# EasyEDA Pro project Mixed PCB.eprj

# Schematic Part1

## Sheets
1 P1: Create Date: 2024-04-20; Page Name: P1; Project Name: Mixed PCB; Schematic Name: Part1; Update Date: 2024-04-20; Company: EasyEDA.com; Drawn: EasyEDA; Page Size: A4; Part Number: JLCPCB-002; Reviewed: EasyEDA; Version: V0.1
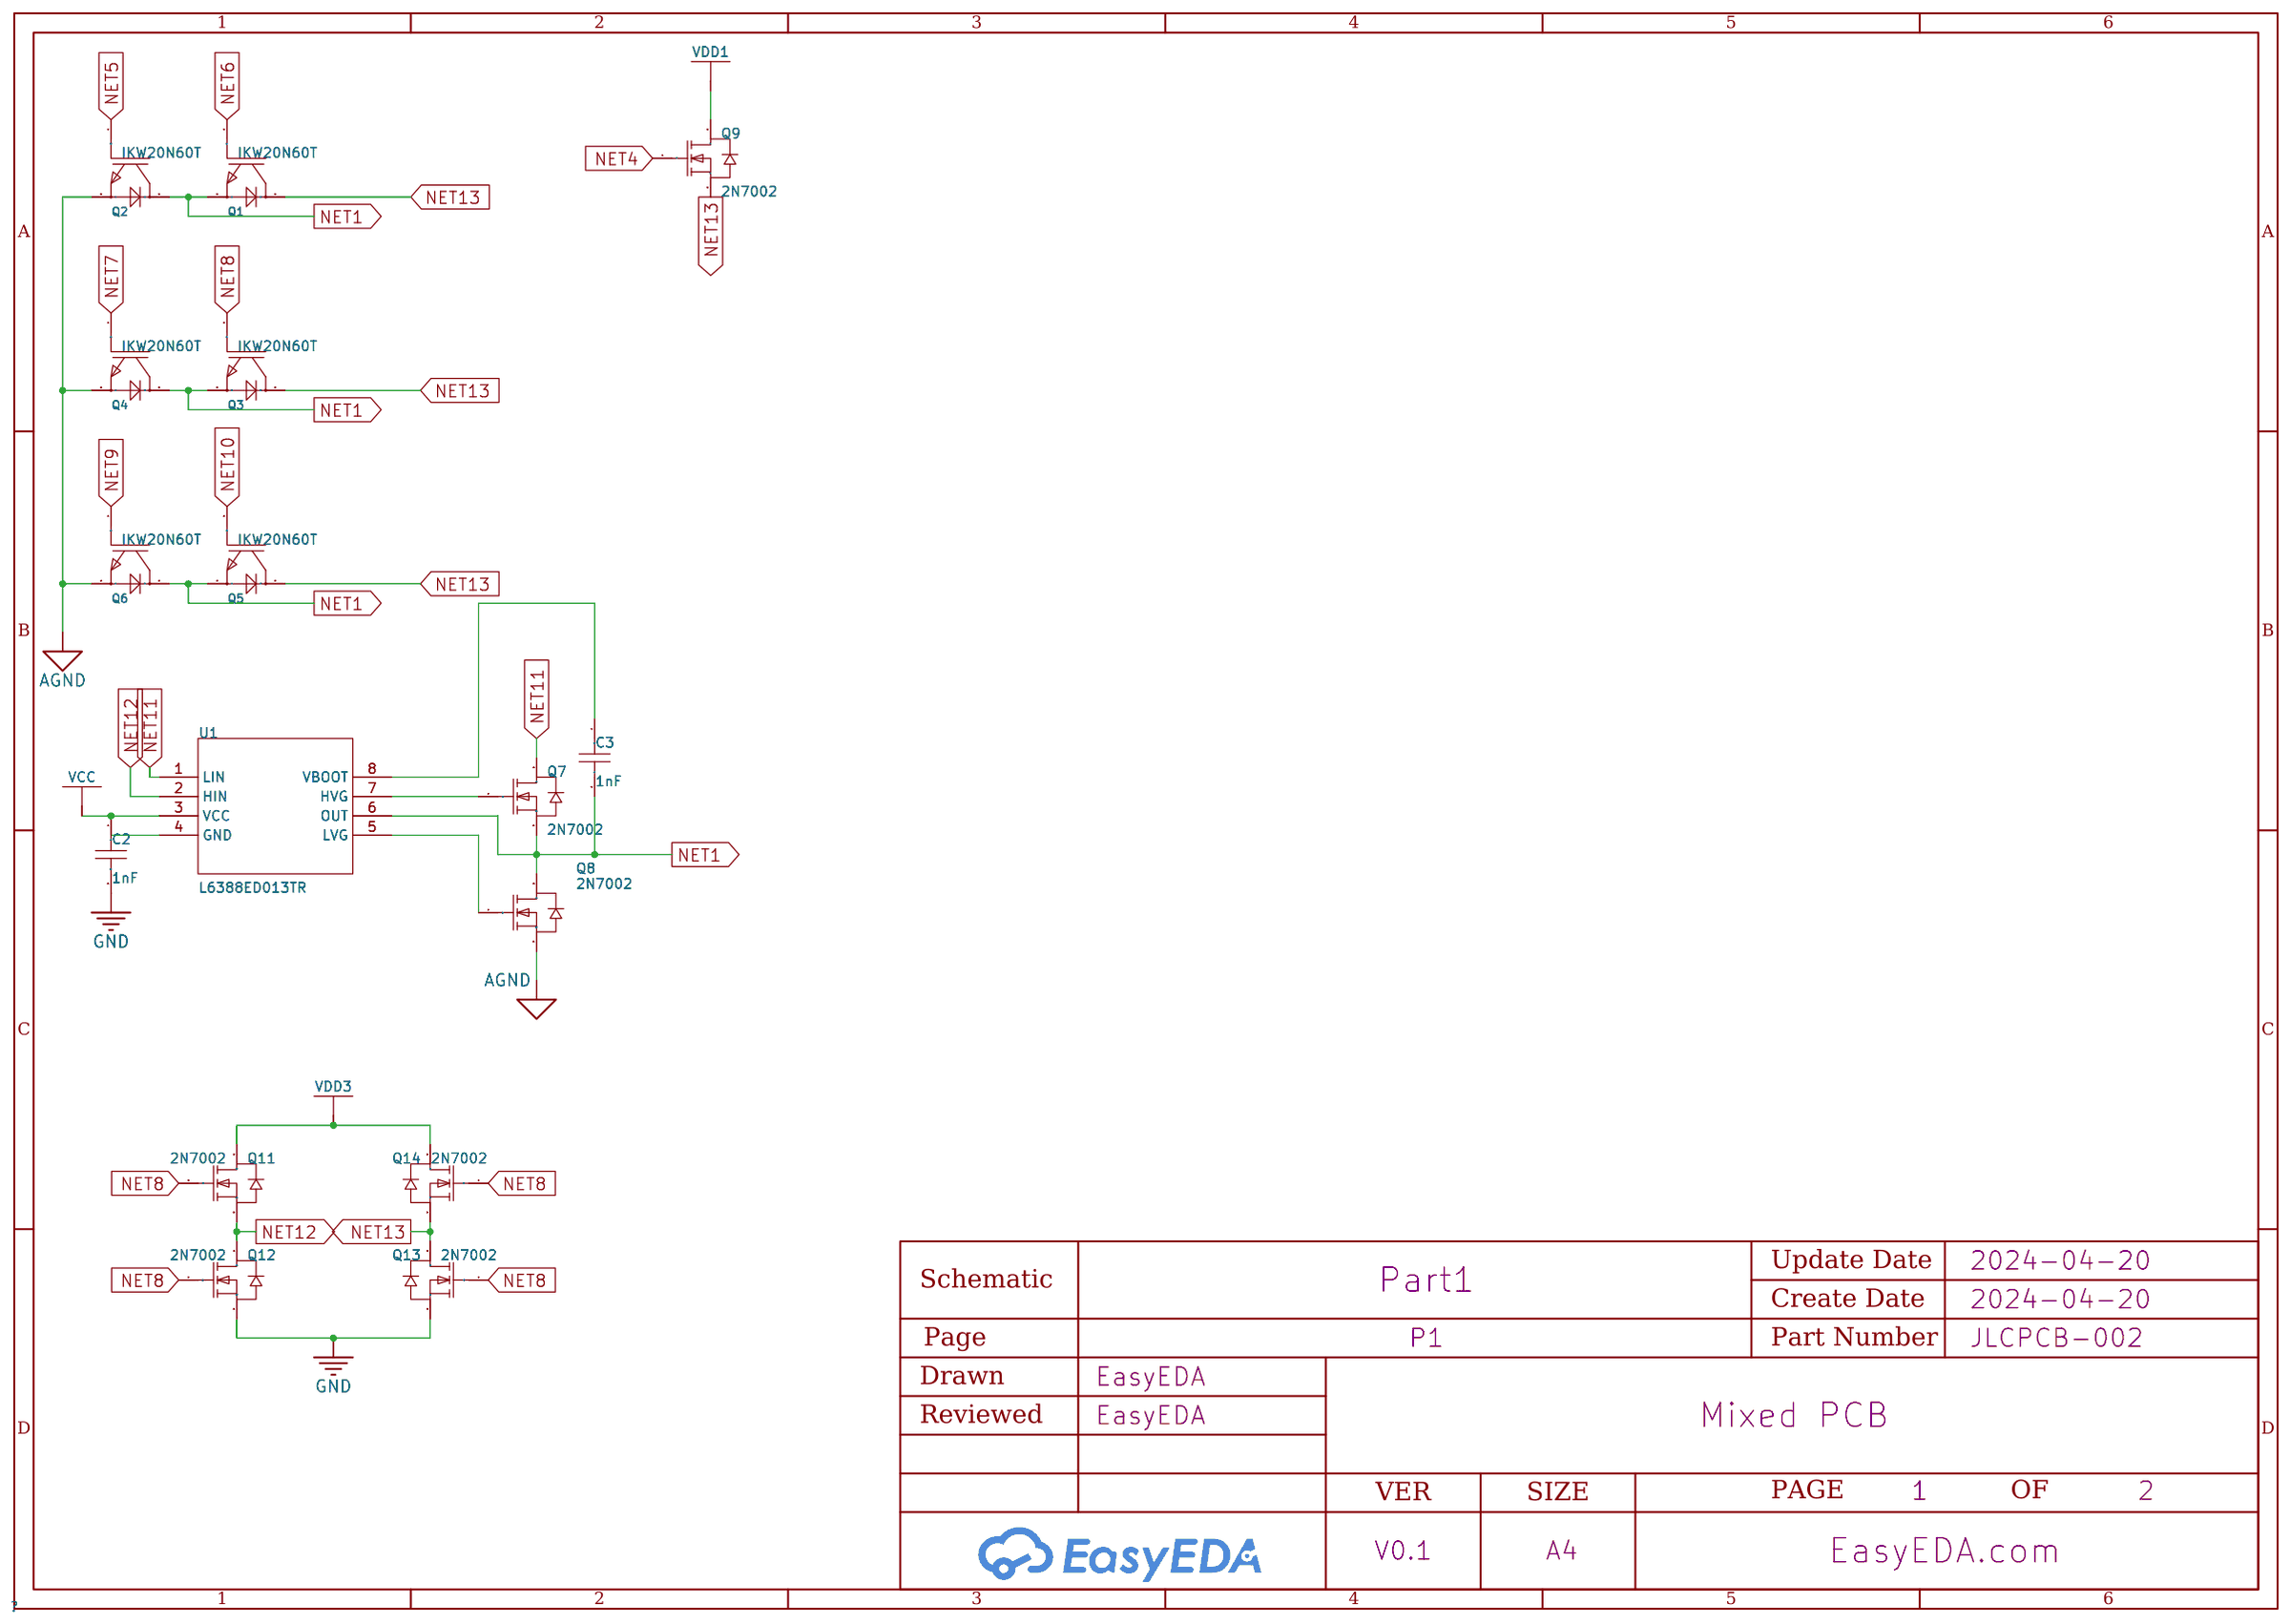
[diagram p0: P1]
2 P2: Page Name: P2
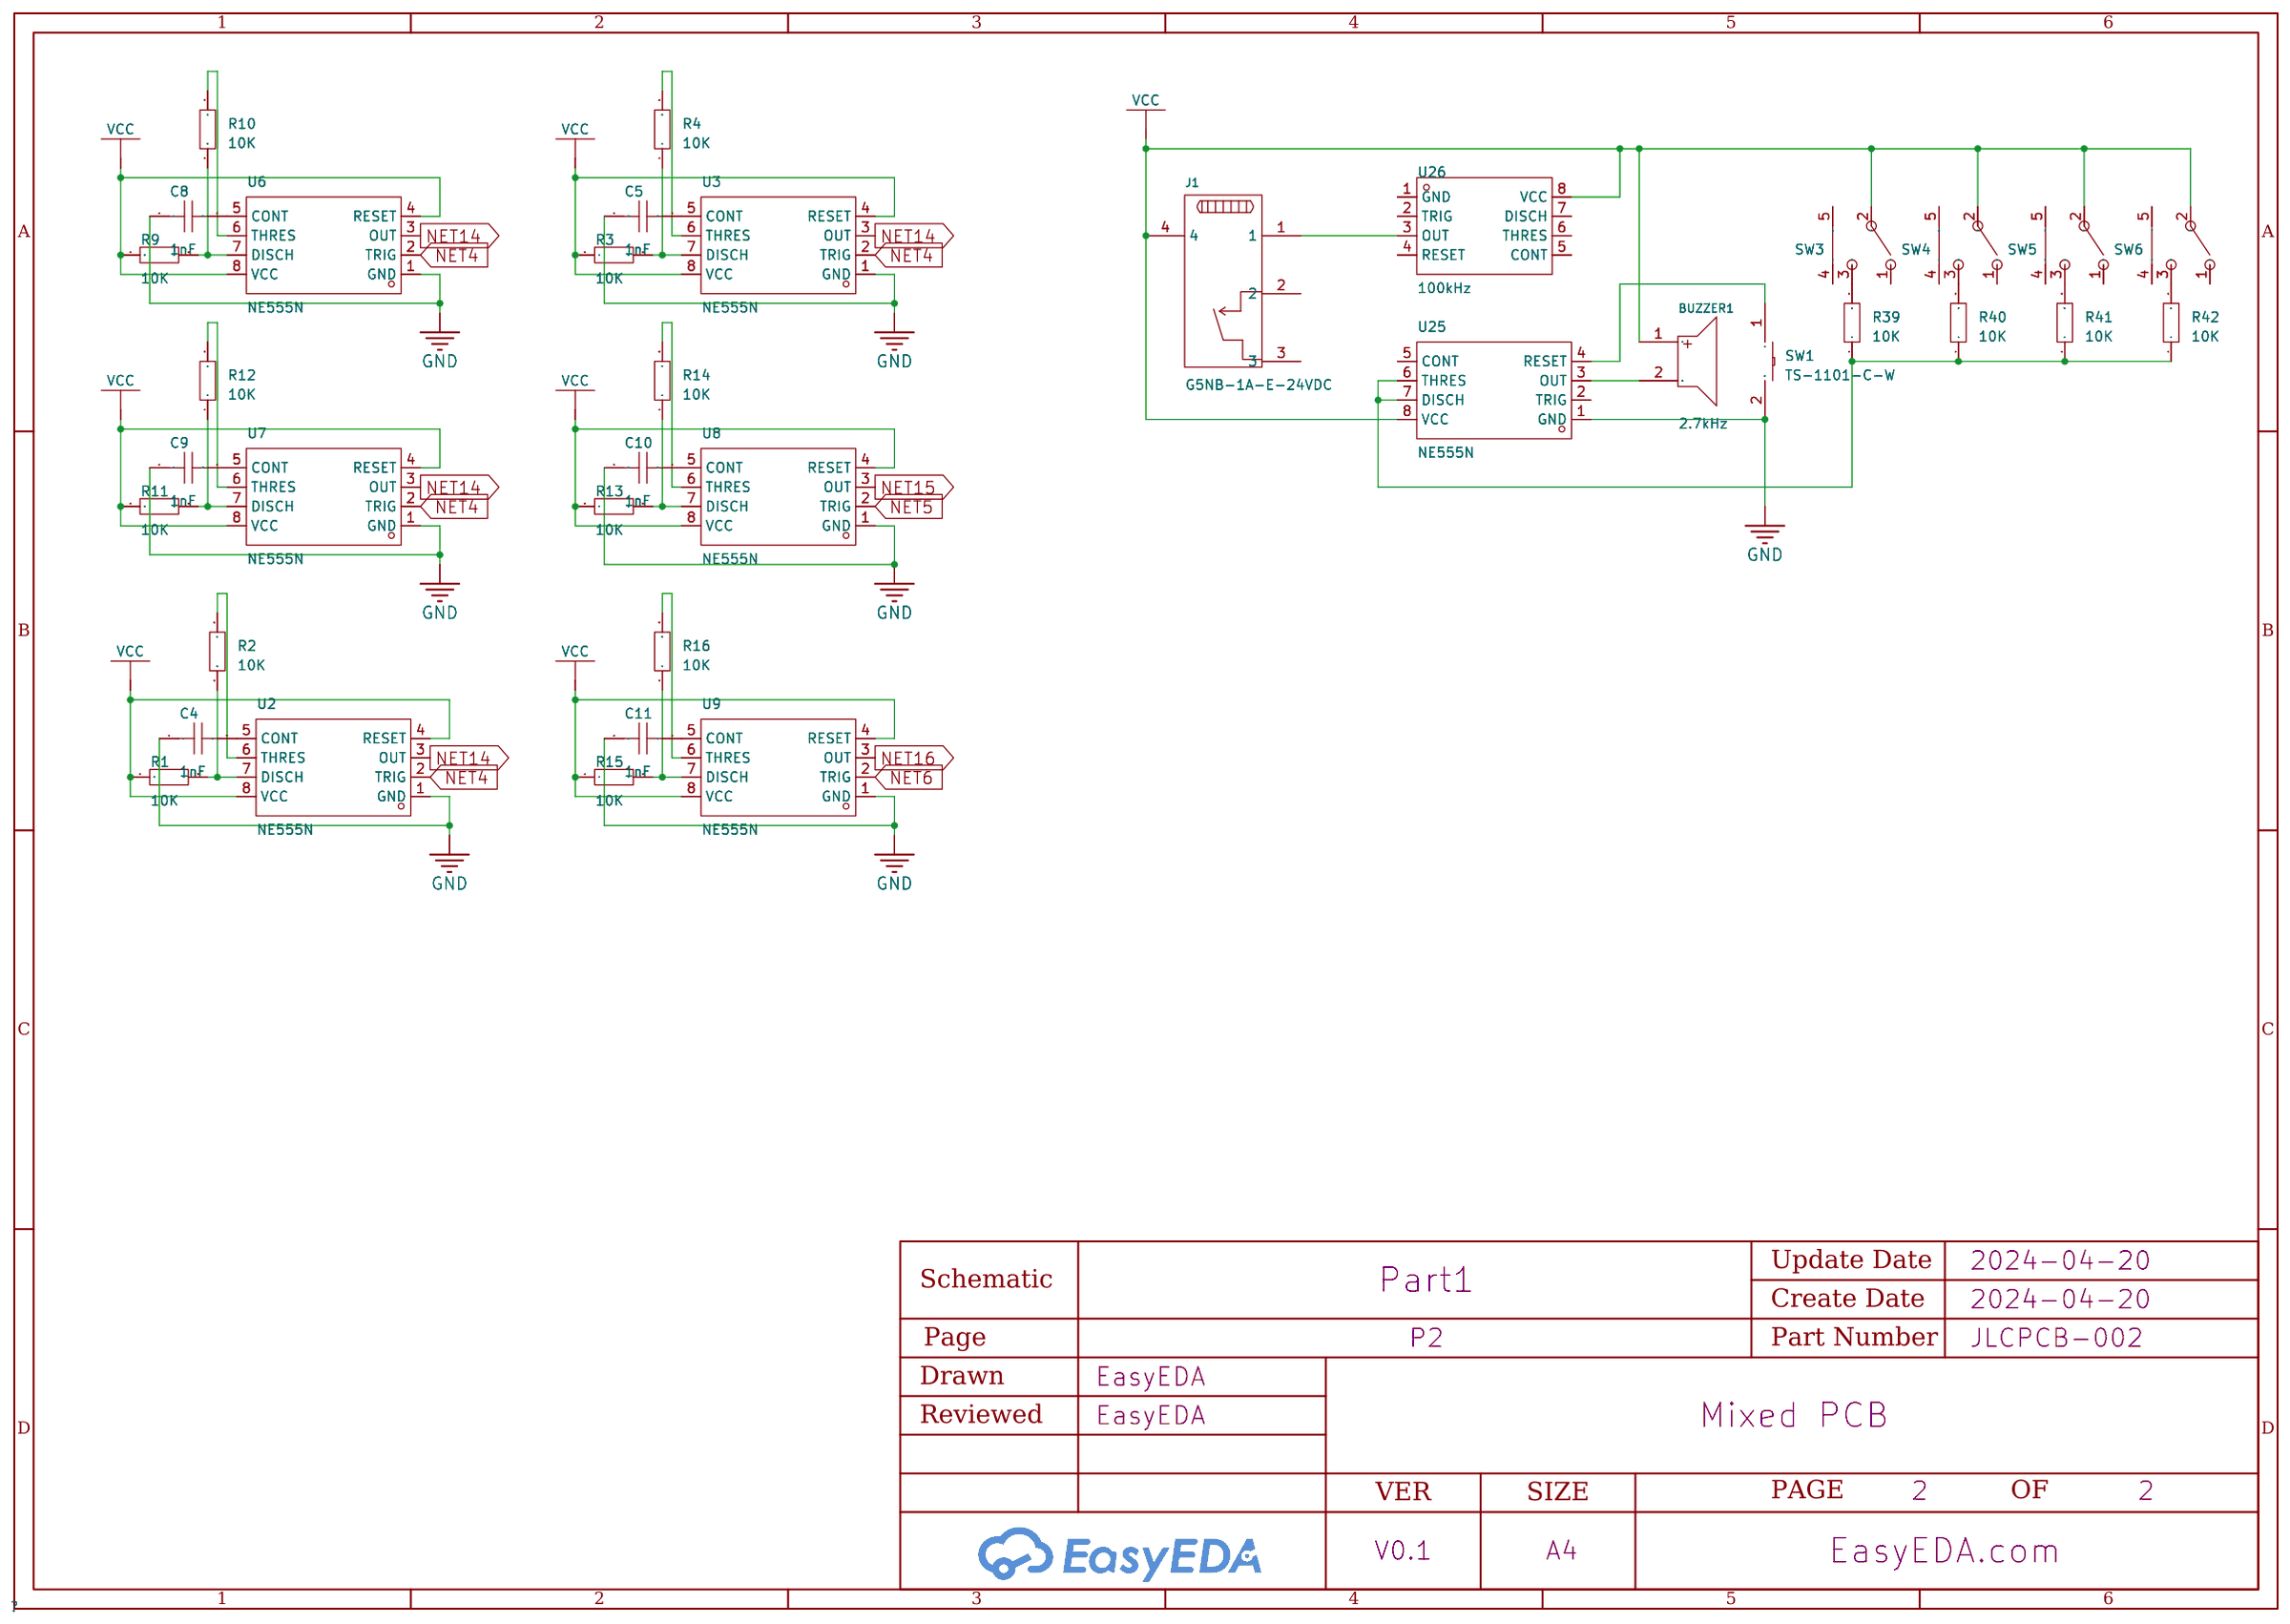
[diagram p1: P2]
3 P3: Page Name: P3
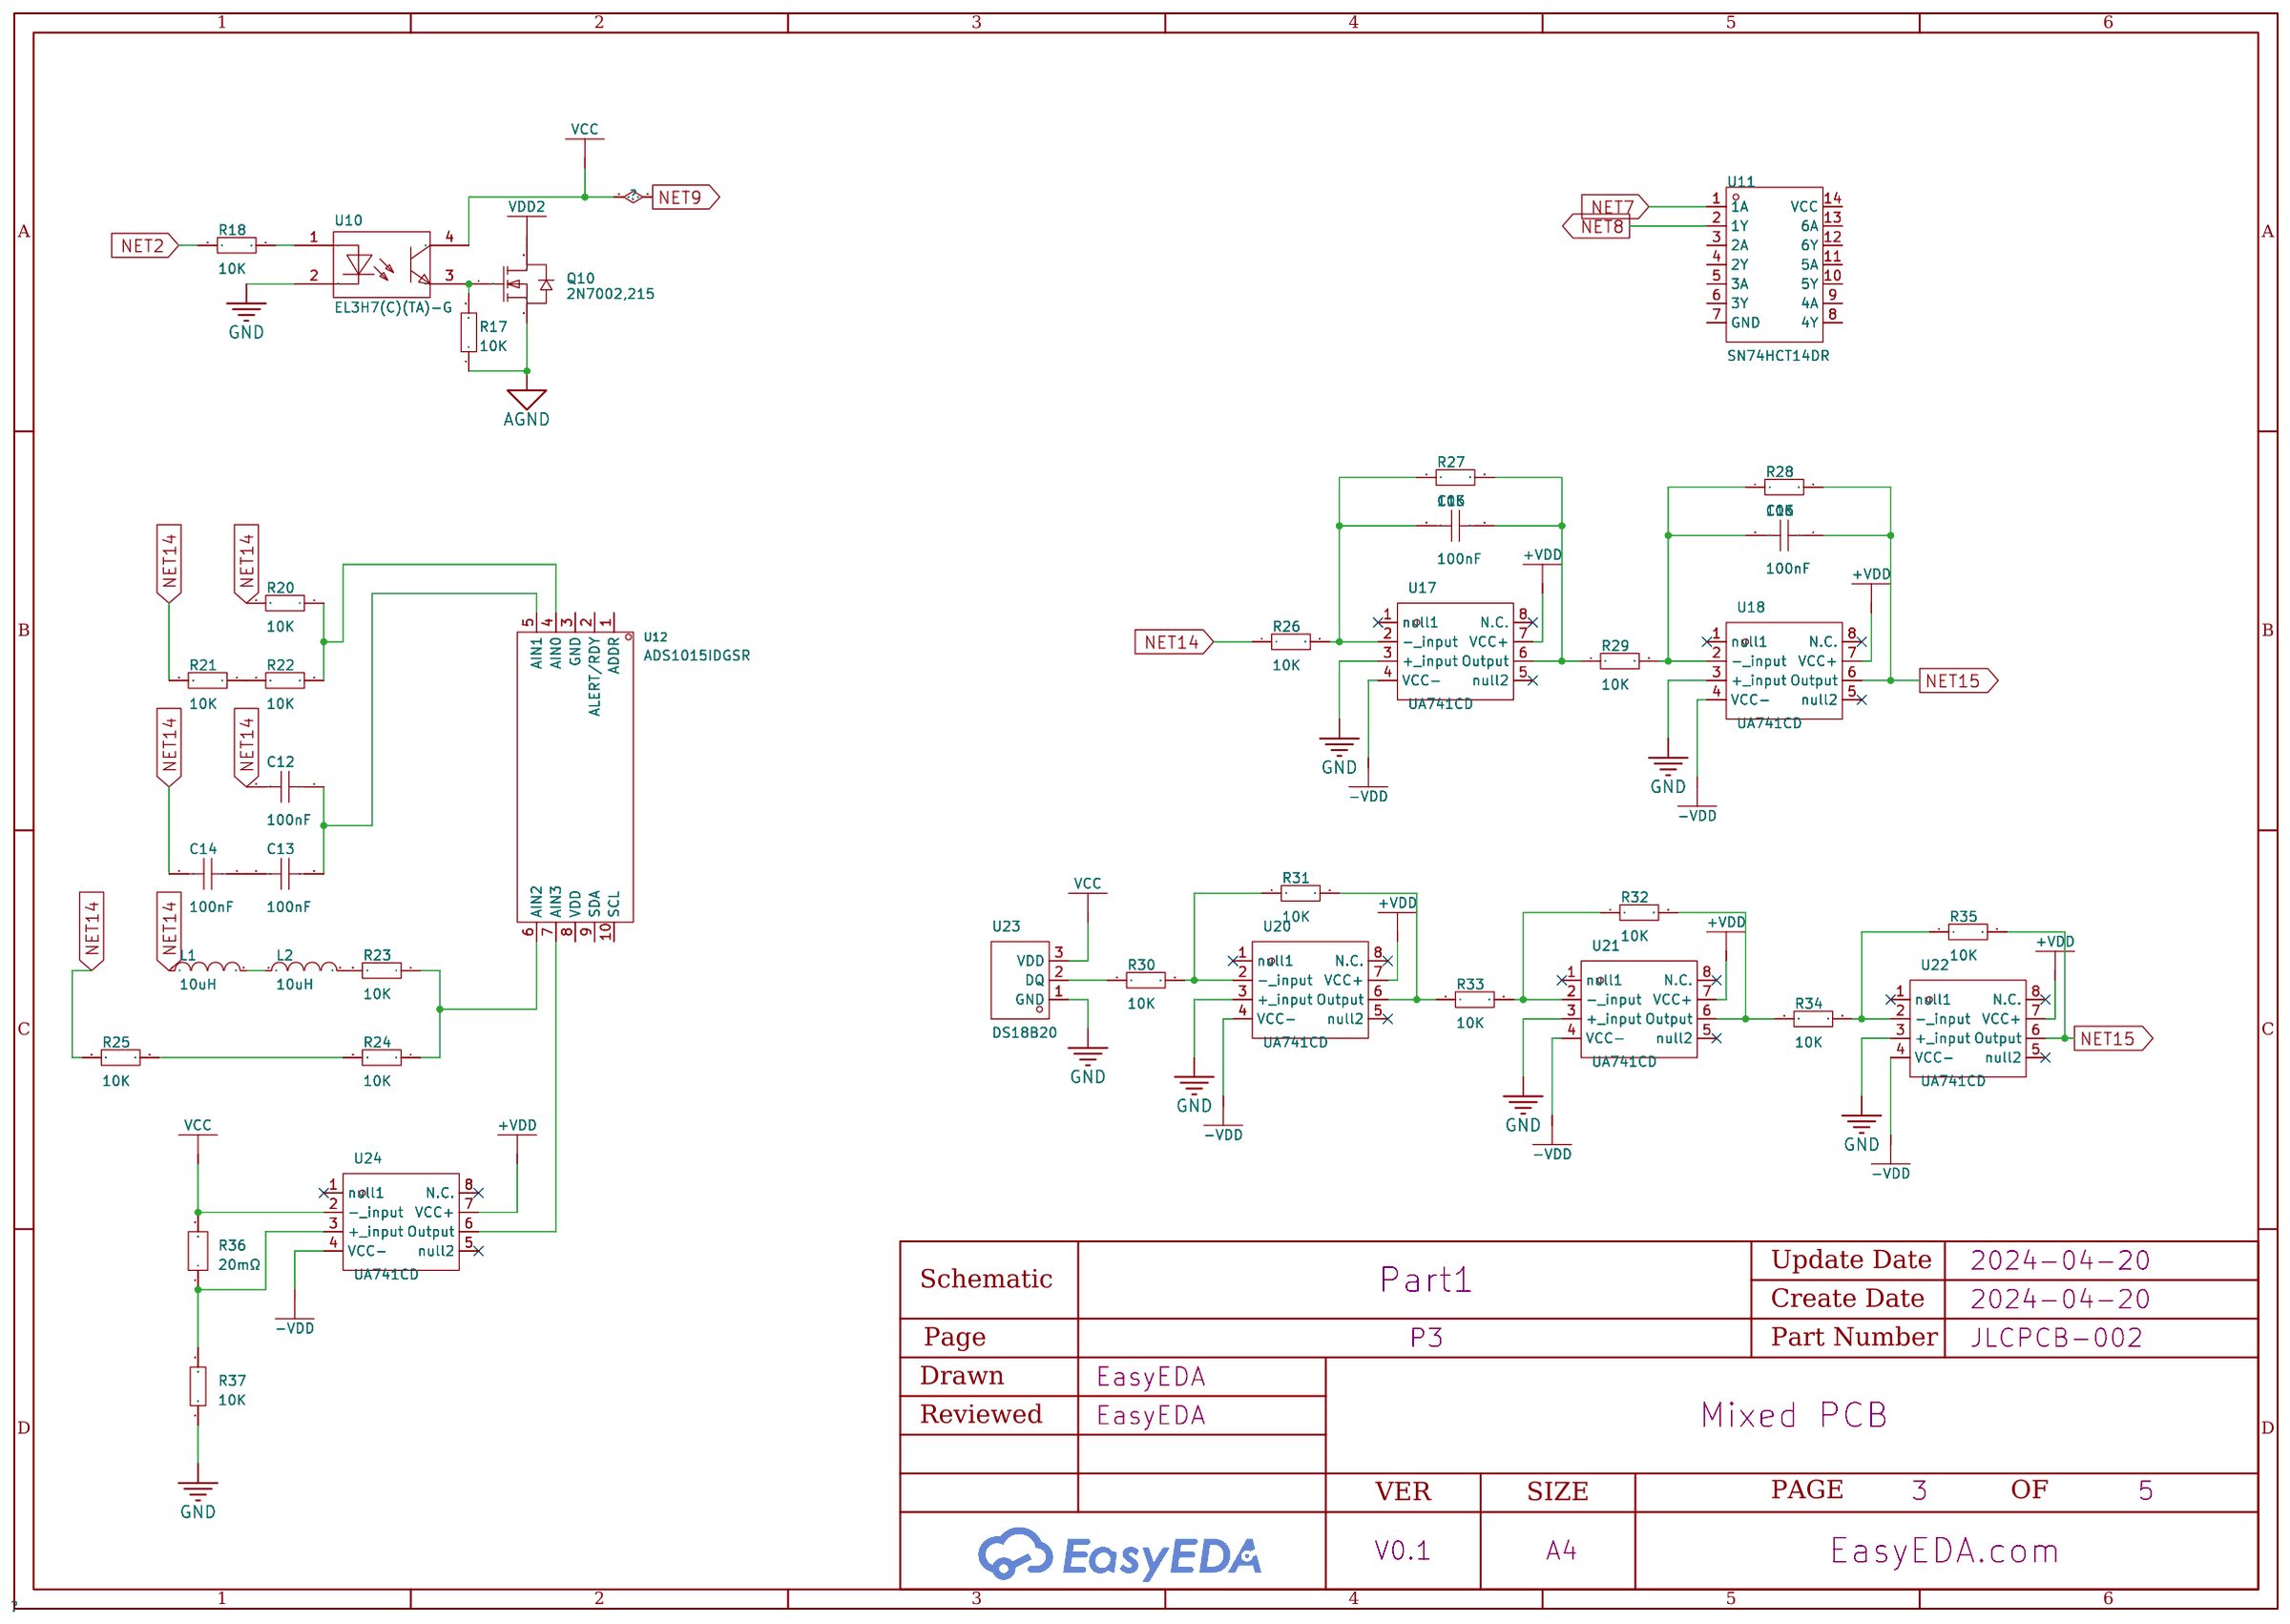
[diagram p2: P3]
4 P4: Page Name: P4
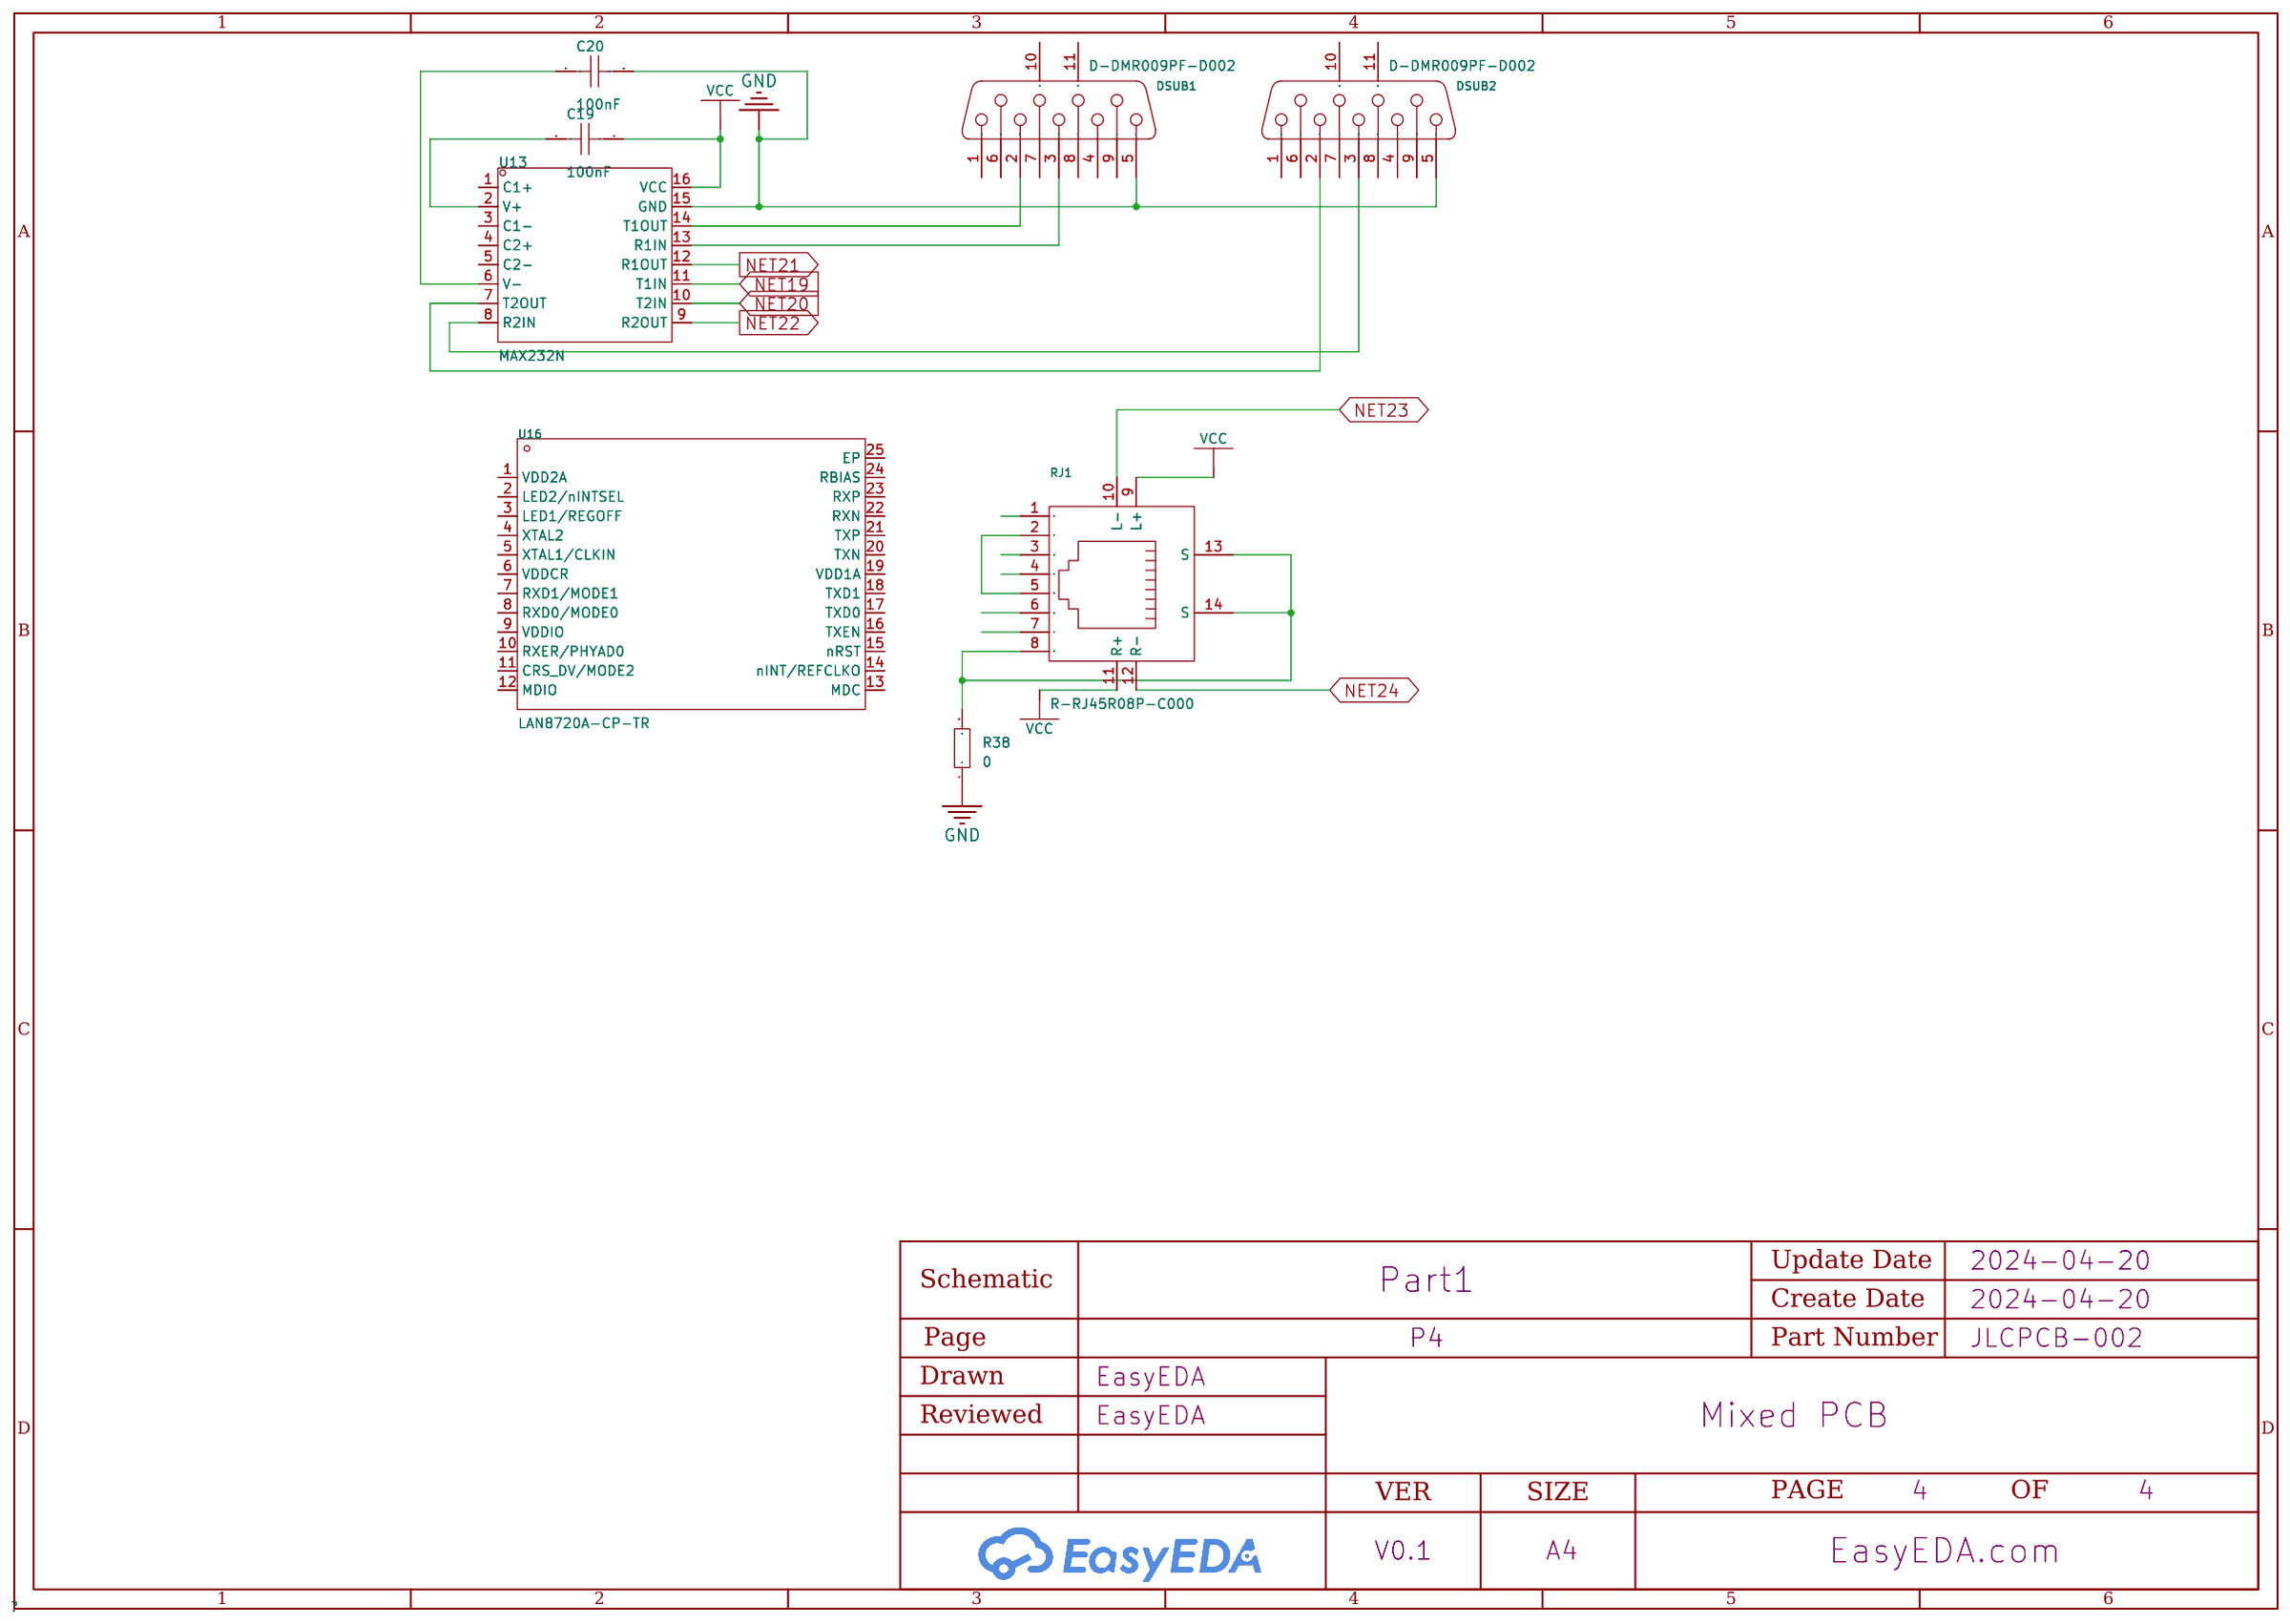
[diagram p3: P4]
5 P5: Page Name: P5
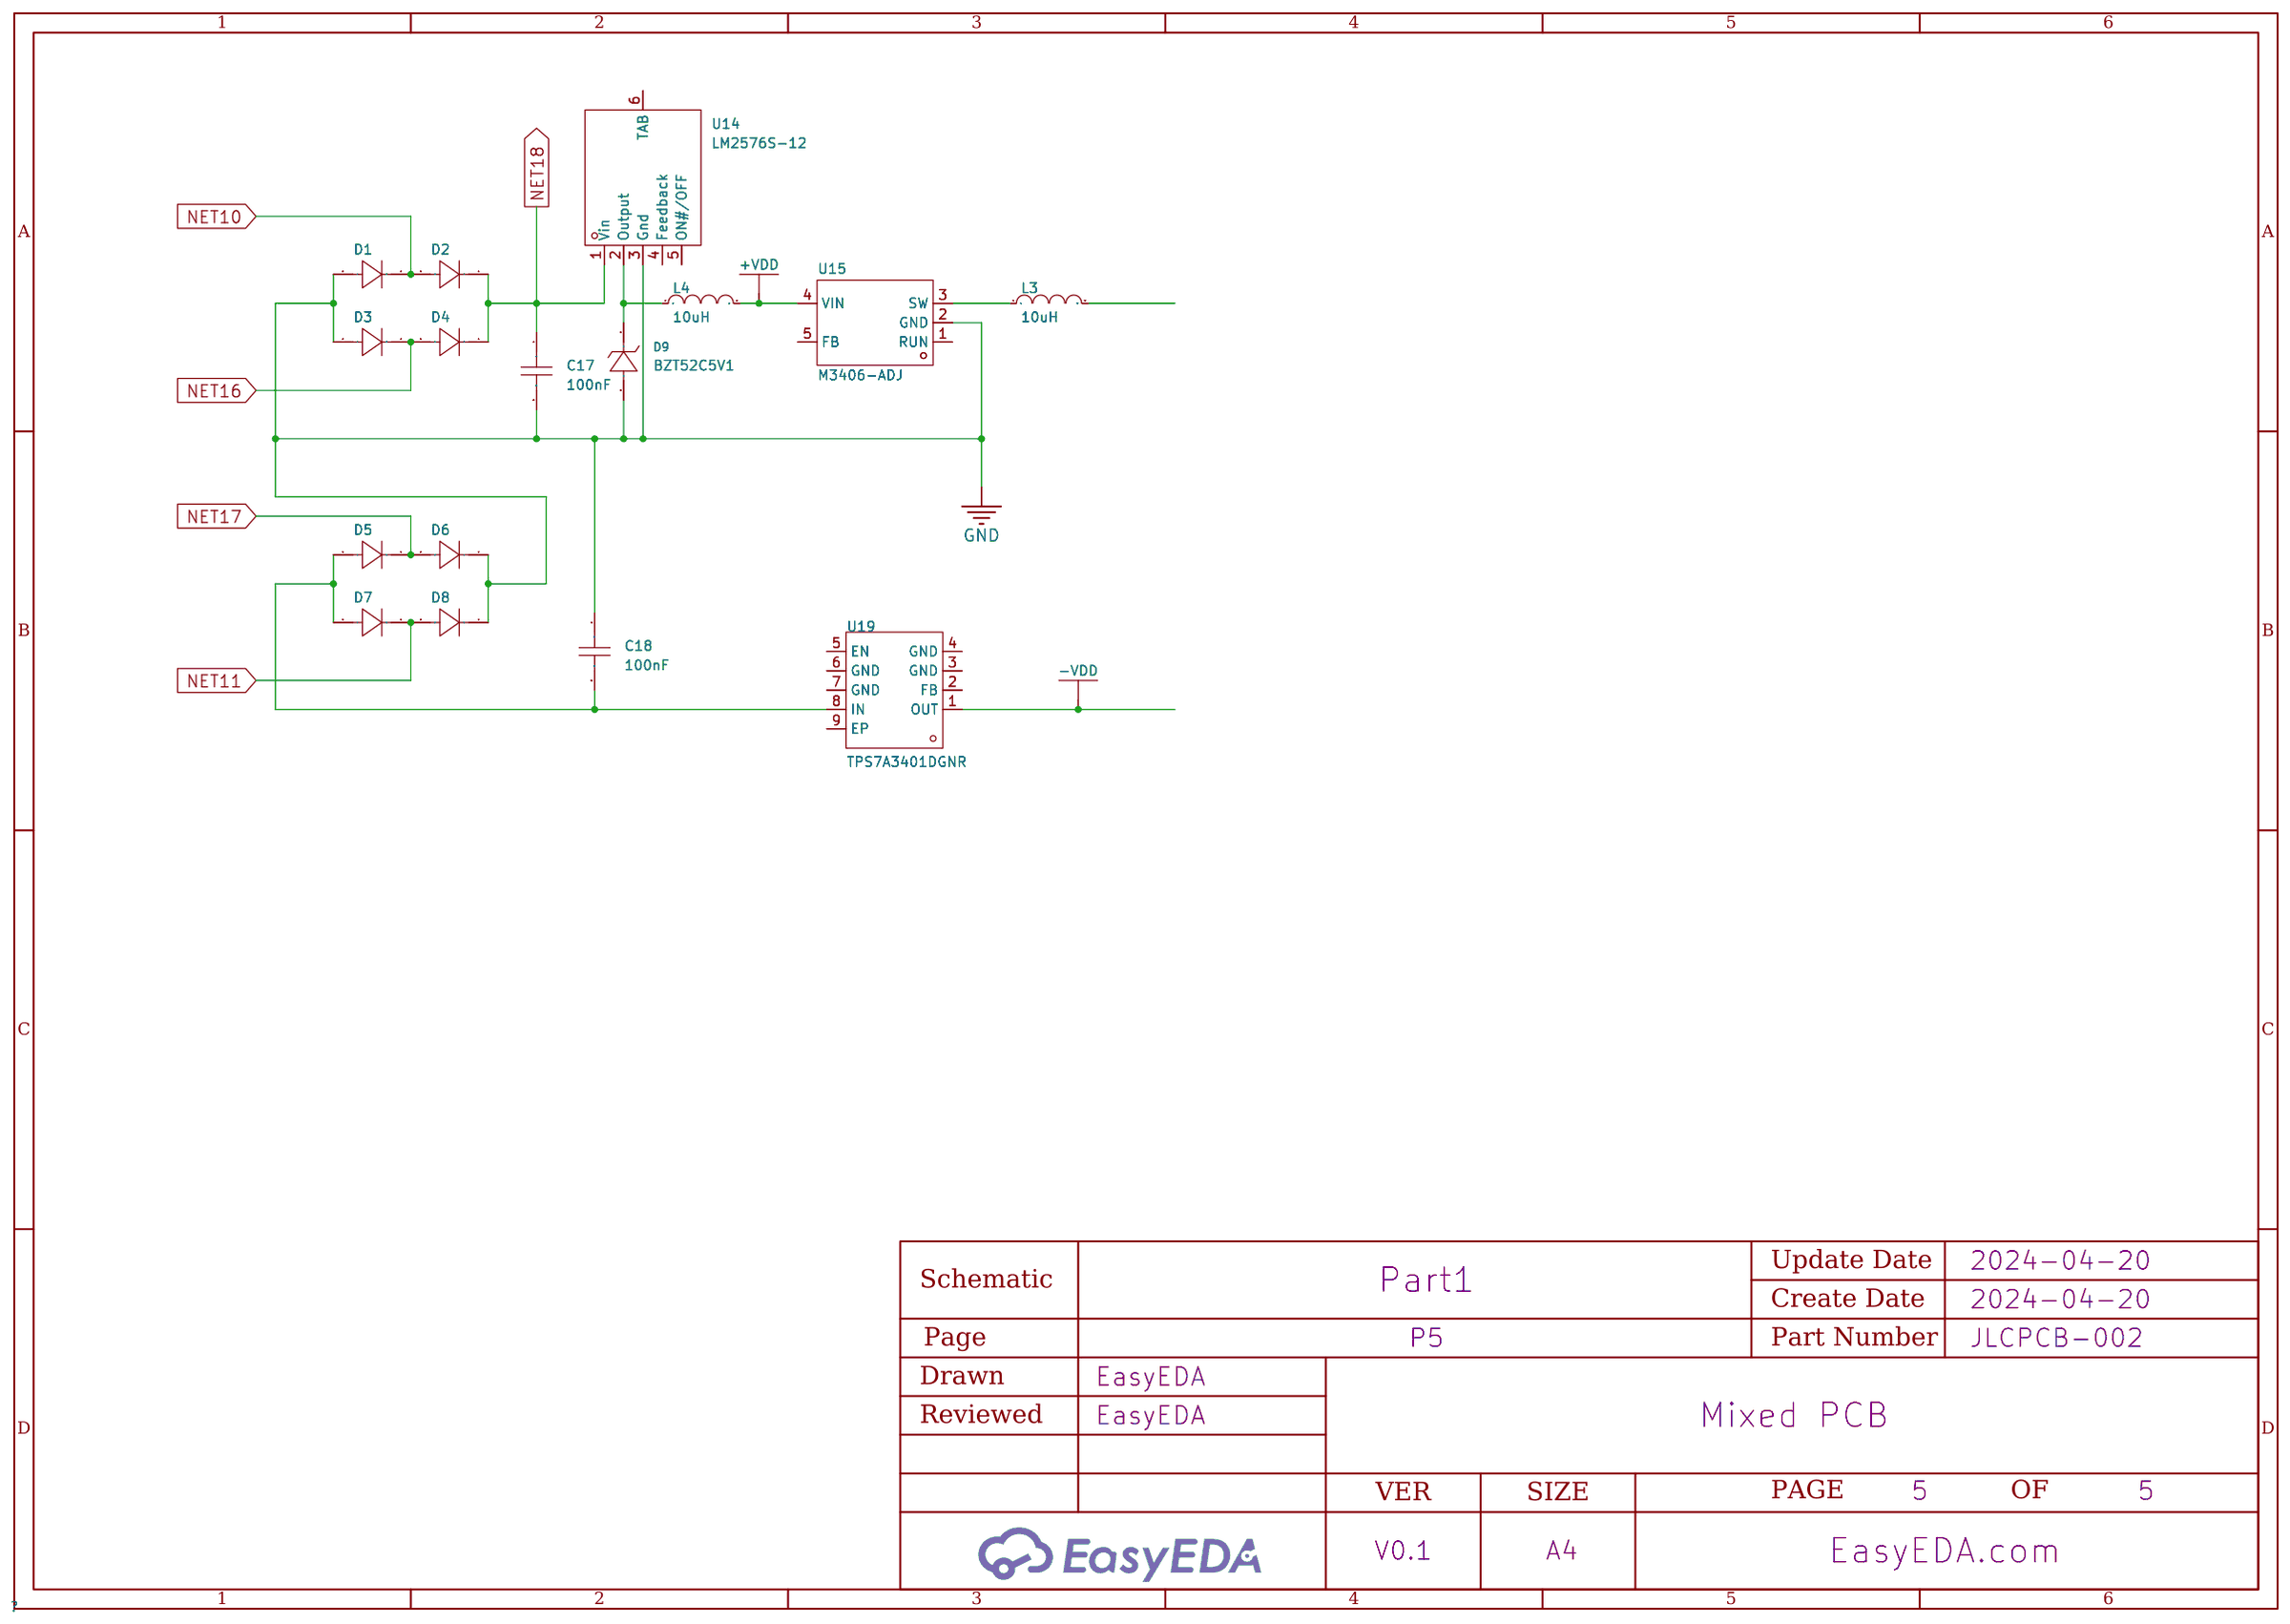
[diagram p4: P5]
6 P6: Page Name: P6; Update Date: 2024-04-21
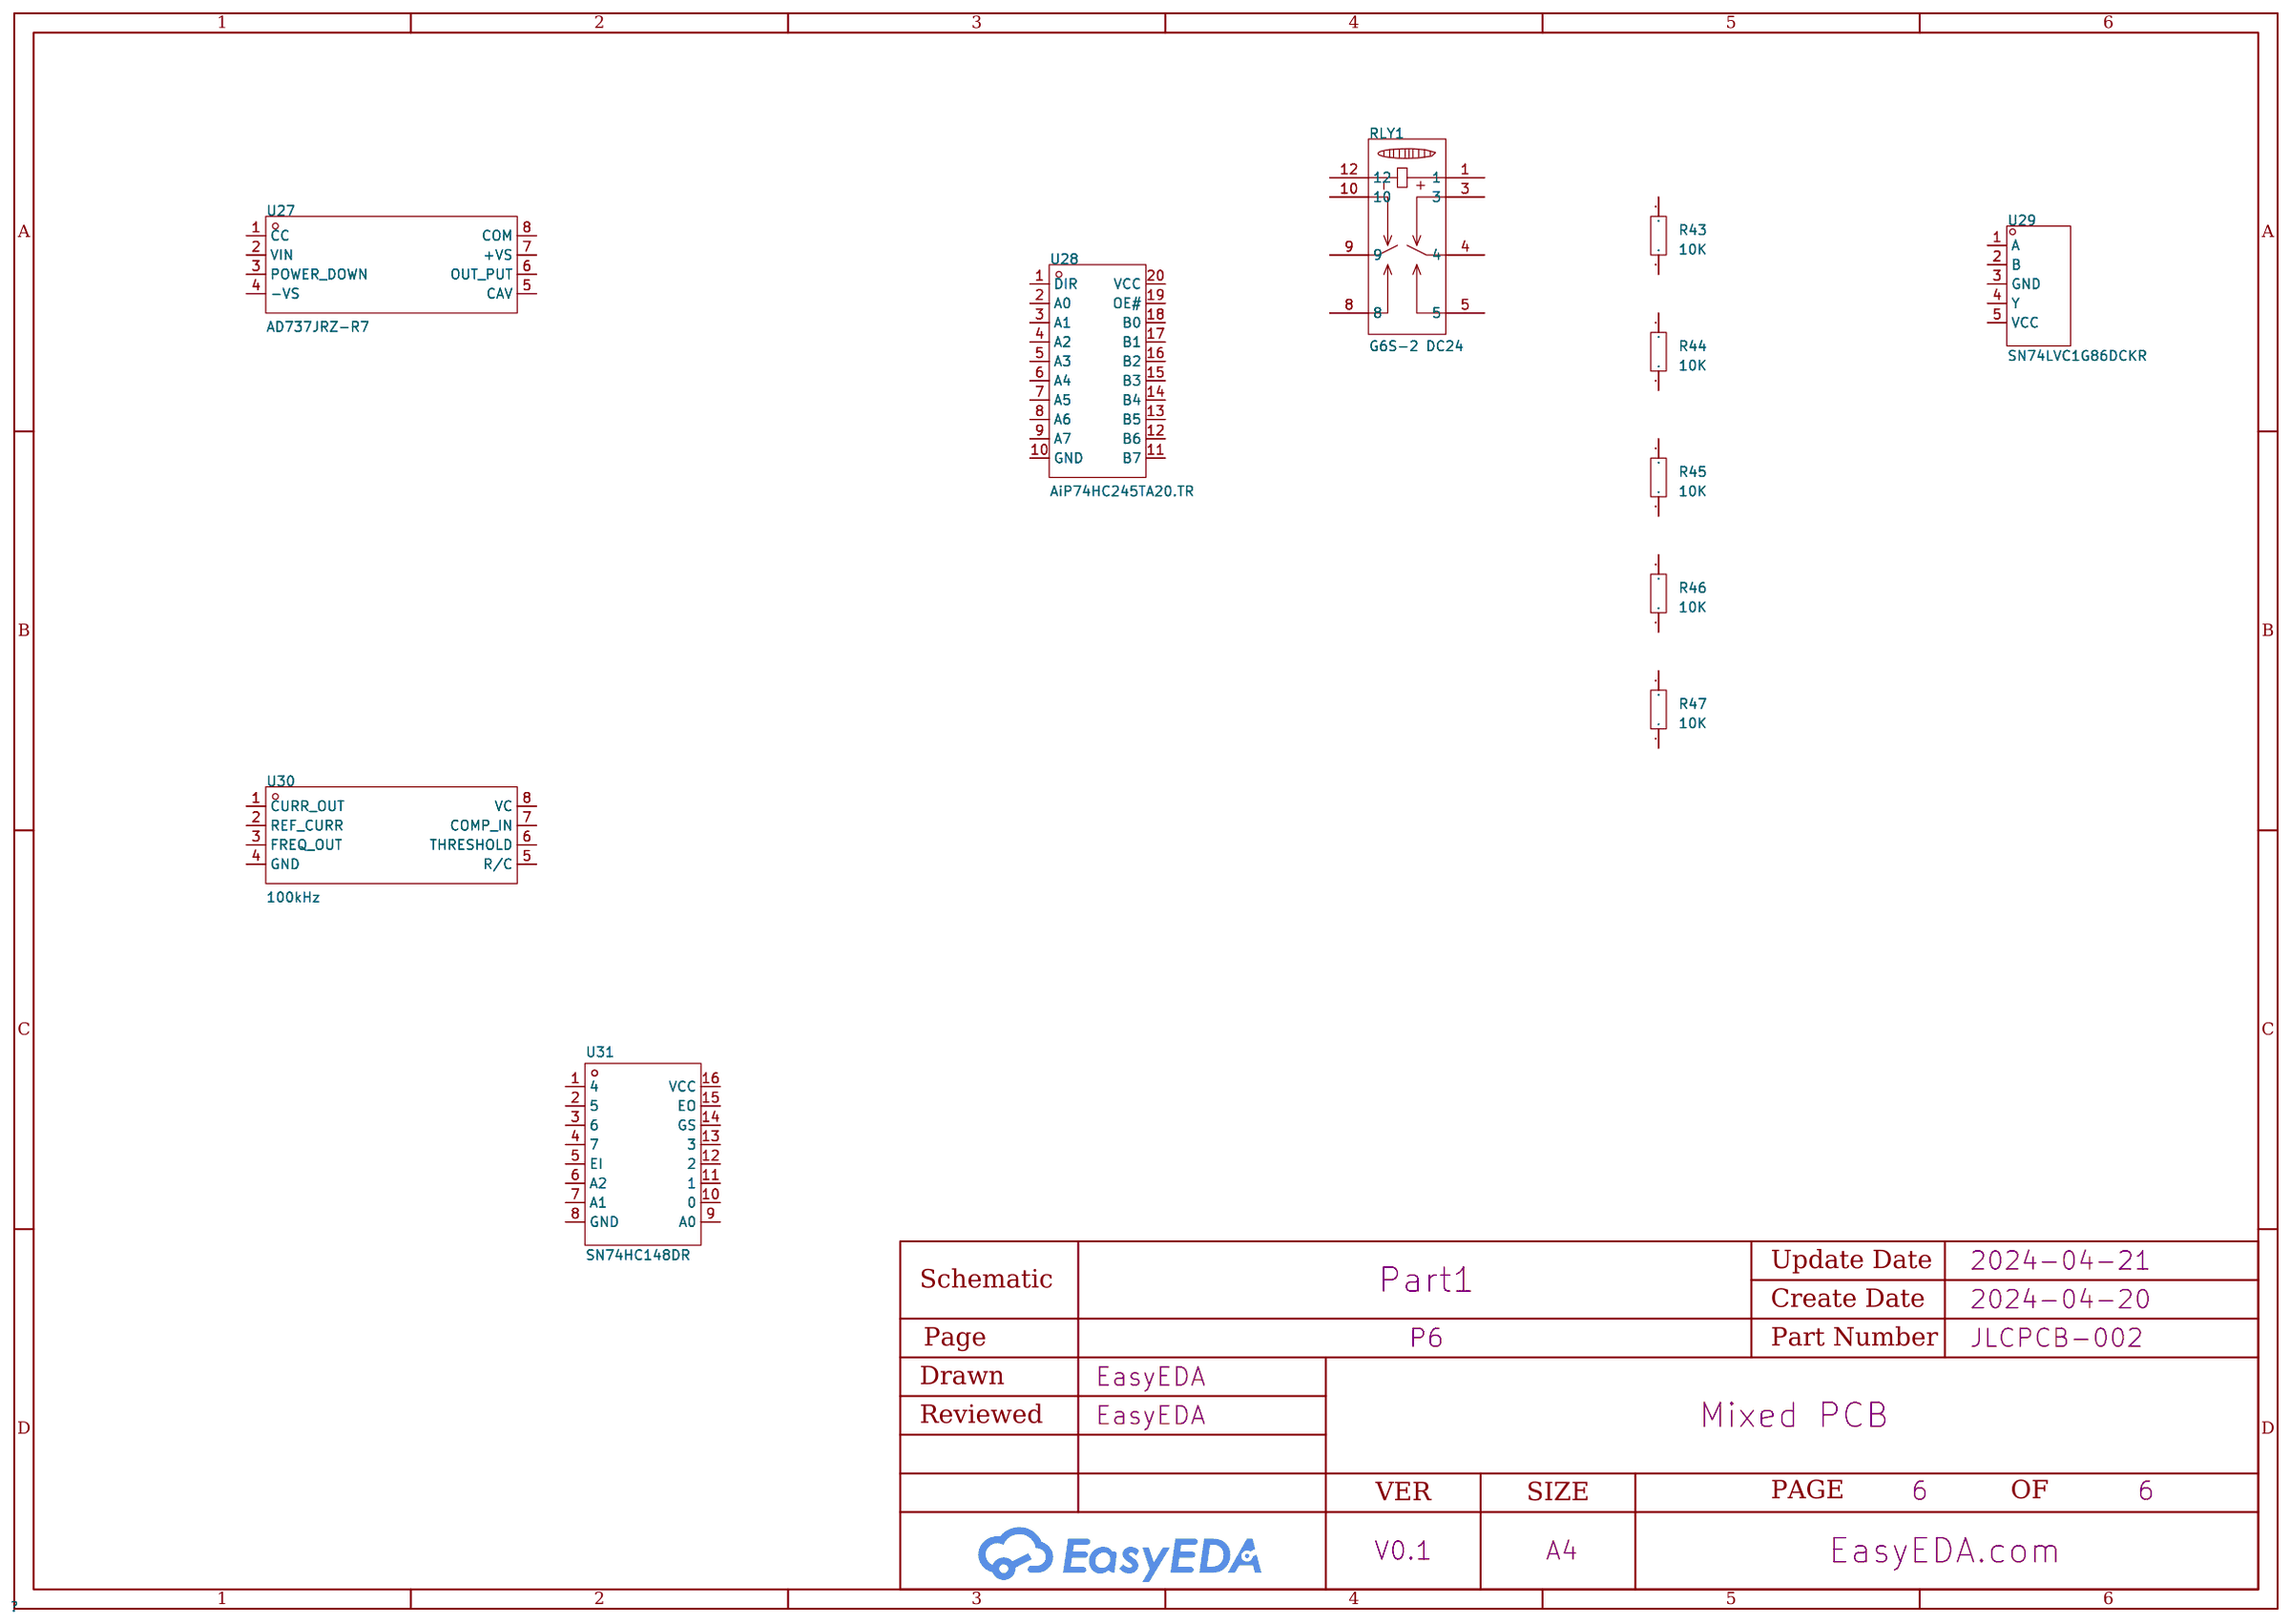
[diagram p5: P6]

## Parts
sheet P1
C2  1nF  [C0603]
C3  1nF  [C0603]
Q1  IKW20N60T  [TO-247AC-3_L15.8-W5.0-P5.46-L]
Q2  IKW20N60T  [TO-247AC-3_L15.8-W5.0-P5.46-L]
Q3  IKW20N60T  [TO-247AC-3_L15.8-W5.0-P5.46-L]
Q4  IKW20N60T  [TO-247AC-3_L15.8-W5.0-P5.46-L]
Q5  IKW20N60T  [TO-247AC-3_L15.8-W5.0-P5.46-L]
Q6  IKW20N60T  [TO-247AC-3_L15.8-W5.0-P5.46-L]
Q7  2N7002  [SOT-23-3_L2.9-W1.3-P1.90-LS2.4-BR]
Q8  2N7002  [SOT-23-3_L2.9-W1.3-P1.90-LS2.4-BR]
Q9  2N7002  [SOT-23-3_L2.9-W1.3-P1.90-LS2.4-BR]
Q11  2N7002  [SOT-23-3_L2.9-W1.3-P1.90-LS2.4-BR]
Q12  2N7002  [SOT-23-3_L2.9-W1.3-P1.90-LS2.4-BR]
Q13  2N7002  [SOT-23-3_L2.9-W1.3-P1.90-LS2.4-BR]
Q14  2N7002  [SOT-23-3_L2.9-W1.3-P1.90-LS2.4-BR]
U1  L6388ED013TR  [SOIC-8_L5.0-W4.0-P1.27-LS6.0-BL]
sheet P2
BUZZER1  2.7kHz  [BUZ-TH_BD9.0-P4.00-D0.6-FD]
C4  1nF  [C0603]
C5  1nF  [C0603]
C8  1nF  [C0603]
C9  1nF  [C0603]
C10  1nF  [C0603]
C11  1nF  [C0603]
J1  G5NB-1A-E-24VDC  [RELAY-TH_G5NB-1A-E-24VDC]
R1  10K  [R0603]
R2  10K  [R0603]
R3  10K  [R0603]
R4  10K  [R0603]
R9  10K  [R0603]
R10  10K  [R0603]
R11  10K  [R0603]
R12  10K  [R0603]
R13  10K  [R0603]
R14  10K  [R0603]
R15  10K  [R0603]
R16  10K  [R0603]
R39  10K  [R0603]
R40  10K  [R0603]
R41  10K  [R0603]
R42  10K  [R0603]
SW1  TS-1101-C-W  [SW-SMD_L6.0-W3.3-LS8.0]
SW3  ST-0-102-C03-N003-RS  [SW-TH_ST-0-102-C03-N003-RS]
SW4  ST-0-102-C03-N003-RS  [SW-TH_ST-0-102-C03-N003-RS]
SW5  ST-0-102-C03-N003-RS  [SW-TH_ST-0-102-C03-N003-RS]
SW6  ST-0-102-C03-N003-RS  [SW-TH_ST-0-102-C03-N003-RS]
U2  NE555N  [DIP-8_L9.8-W6.6-P2.54-LS7.6-BL]
U3  NE555N  [DIP-8_L9.8-W6.6-P2.54-LS7.6-BL]
U6  NE555N  [DIP-8_L9.8-W6.6-P2.54-LS7.6-BL]
U7  NE555N  [DIP-8_L9.8-W6.6-P2.54-LS7.6-BL]
U8  NE555N  [DIP-8_L9.8-W6.6-P2.54-LS7.6-BL]
U9  NE555N  [DIP-8_L9.8-W6.6-P2.54-LS7.6-BL]
U25  NE555N  [DIP-8_L9.8-W6.6-P2.54-LS7.6-BL]
U26  100kHz  [DIP-8_L9.8-W6.6-P2.54-LS7.6-BL]
sheet P3
C12  100nF  [C0603]
C13  100nF  [C0603]
C14  100nF  [C0603]
C15  100nF  [C0603]
C16  100nF  [C0603]
L1  10uH  [L0603]
L2  10uH  [L0603]
Q10  2N7002,215  [SOT-23_L2.9-W1.3-P1.90-LS2.4-BR]
R17  10K  [R0603]
R18  10K  [R0603]
R20  10K  [R0603]
R21  10K  [R0603]
R22  10K  [R0603]
R23  10K  [R0603]
R24  10K  [R0603]
R25  10K  [R0603]
R26  10K  [R0603]
R27  10K  [R0603]
R28  10K  [R0603]
R29  10K  [R0603]
R30  10K  [R0603]
R31  10K  [R0603]
R32  10K  [R0603]
R33  10K  [R0603]
R34  10K  [R0603]
R35  10K  [R0603]
R36  20mΩ  [R1206]
R37  10K  [R0603]
U10  EL3H7(C)(TA)-G  [SMD-4_L2.7-W4.4-P1.27-LS7.0-BL]
U11  SN74HCT14DR  [SOIC-14_L8.7-W3.9-P1.27-LS6.0-BL]
U12  ADS1015IDGSR  [VSSOP-10_L3.0-W3.0-P0.50-LS4.9-BL]
U17  UA741CD  [SO-8_L4.9-W3.9-P1.27-LS6.0-BL]
U18  UA741CD  [SO-8_L4.9-W3.9-P1.27-LS6.0-BL]
U20  UA741CD  [SO-8_L4.9-W3.9-P1.27-LS6.0-BL]
U21  UA741CD  [SO-8_L4.9-W3.9-P1.27-LS6.0-BL]
U22  UA741CD  [SO-8_L4.9-W3.9-P1.27-LS6.0-BL]
U23  DS18B20  [TO-92-3_L4.9-W3.7-P1.27-L]
U24  UA741CD  [SO-8_L4.9-W3.9-P1.27-LS6.0-BL]
sheet P4
C19  100nF  [C0603]
C20  100nF  [C0603]
DSUB1  D-DMR009PF-D002  [DSUB-TH_DMR-9S]
DSUB2  D-DMR009PF-D002  [DSUB-TH_DMR-9S]
R38  0  [R0603]
RJ1  R-RJ45R08P-C000  [RJ45-TH_R-RJ45R08P-C000]
U13  MAX232N  [PDIP-16_L19.7-W6.6-P2.54-LS7.8-BL]
U16  LAN8720A-CP-TR  [QFN-24_L4.0-W4.0-P0.50-BL-EP2.6]
sheet P5
C17  100nF  [C0603]
C18  100nF  [C0603]
D1  -  [DO-41_BD2.4-L4.7-P8.70-D0.9-RD]
D2  -  [DO-41_BD2.4-L4.7-P8.70-D0.9-RD]
D3  -  [DO-41_BD2.4-L4.7-P8.70-D0.9-RD]
D4  -  [DO-41_BD2.4-L4.7-P8.70-D0.9-RD]
D5  -  [DO-41_BD2.4-L4.7-P8.70-D0.9-RD]
D6  -  [DO-41_BD2.4-L4.7-P8.70-D0.9-RD]
D7  -  [DO-41_BD2.4-L4.7-P8.70-D0.9-RD]
D8  -  [DO-41_BD2.4-L4.7-P8.70-D0.9-RD]
D9  BZT52C5V1  [SOD-123_L2.8-W1.8-LS3.7-RD-1]
L3  10uH  [L0603]
L4  10uH  [L0603]
U14  LM2576S-12  [TO-263-5_L10.2-W8.9-P1.70-BR]
U15  M3406-ADJ  [SOT-23-5_L3.0-W1.7-P0.95-LS2.8-BR]
U19  TPS7A3401DGNR  [MSOP-8_L3.0-W3.0-P0.65-LS4.9-BL-EP]
sheet P6
R43  10K  [R0603]
R44  10K  [R0603]
R45  10K  [R0603]
R46  10K  [R0603]
R47  10K  [R0603]
RLY1  G6S-2 DC24  [RELAY-TH_G6S-2-4.5V]
U27  AD737JRZ-R7  [SOIC-8_L4.9-W3.9-P1.27-LS6.0-BL]
U28  AiP74HC245TA20.TR  [TSSOP-20_L6.5-W4.4-P0.65-LS6.5-BL]
U29  SN74LVC1G86DCKR  [SC-70-5_L2.1-W1.3-P0.65-LS2.1-BR]
U30  100kHz  [SOP-8_L4.9-W3.9-P1.27-LS6.0-BL]
U31  SN74HC148DR  [SOIC-16_L9.9-W3.9-P1.27-LS6.0-BL]

## Library data of the parts
C2-C5 C8-C20 = CAP_0603: Supplier Footprint: 0603
Q1-Q6 = IKW20N60T: Supplier Part: C10456; Manufacturer: Infineon(英飞凌); Supplier Footprint: TO-247AC-3; JLCPCB Part Class: Extended Part; Datasheet: https://atta.szlcsc.com/upload/public/pdf/source/20121215/1457706569365.pdf; Supplier: LCSC
Q7-Q9 Q11-Q14 = 2N7002_C8545: Type: Drain Source Voltage (Vdss): Continuous Drain Current (Id): Power Dissipation (Pd): Drain Source On Resistance (RDS(on)@Vgs,Id):7.5Ω@10V,500mA Gate Threshold Voltage (Vgs(th)@Id):2.5V@250uA; LCSC Part Name: N沟道 耐压:60V 电流:115mA; Supplier Part: C8545; Manufacturer: CJ(江苏长电/长晶); Supplier Footprint: SOT-23; JLCPCB Part Class: Basic Part; Datasheet: https://atta.szlcsc.com/upload/public/pdf/source/20171228/C164913_15144413269051213916.pdf; Supplier: LCSC; Drain Source On Resistance (RDS(on)@Vgs,Id): 7.5Ω@10V,500mA; Gate Threshold Voltage (Vgs(th)@Id): 2.5V@250uA
U1 = L6388ED013TR: Driven Configuration:Half Bridge Load Type:MOSFET；IGBT Number of Drivers:2 Peak Output Current(sink):650mA Peak Output Current(source):400mA Supply Voltage:17V Supply Voltage:17V Rise Time:70ns Fall Time:40ns Operating Temperature:-40℃~+125℃@(Tj) Operatin; Supplier Part: C23921; Manufacturer: ST(意法半导体); Supplier Footprint: SOIC-8; JLCPCB Part Class: Extended Part; Datasheet: https://atta.szlcsc.com/upload/public/pdf/source/20140319/1457707022109.pdf; Supplier: LCSC; Driven Configuration: Half Bridge; Load Type: MOSFET；IGBT; Number of Drivers: 2; Peak Output Current(sink): 650mA; Peak Output Current(source): 400mA; Supply Voltage: 17V; Rise Time: 70ns; Fall Time: 40ns; Operating Temperature: -40℃~+125℃@(Tj)
BUZZER1 = QMB-09B-03: Oscillator Circuit:无源(外部驱动) Technology Type:电磁式 Operating Voltage:2V~5V Operating Voltage:2V~5V Frequency:2.7kHz Sound Pressure Level (SPL):85dB@3V,10cm Diameter (φD):9mm Height:5.7mm; LCSC Part Name: 无源蜂鸣器QMB-09B-03; Supplier Part: C96256; Manufacturer: 华能; Supplier Footprint: 插件,D=9mm; JLCPCB Part Class: Extended Part; Datasheet: https://atta.szlcsc.com/upload/public/pdf/source/20210401/C96256_958B17753B5AD7CBFBCFFC7C095B4484.pdf; Supplier: LCSC; Oscillator Circuit: 无源(外部驱动); Technology Type: 电磁式; Operating Voltage: 2V~5V; Sound Pressure Level (SPL): 85dB@3V,10cm; Diameter (φD): 9mm; Height: 5.7mm
J1 = G5NB-1A-E-24VDC: Coil Voltage:- Contact Form:- Pin Number:- Contact Rating:- Maximum Switching Voltage:- Contact Material:- Maximum Switching Current:- Coil Type: Coil Resistance:- Contact Resistance:- Operate Time:- Release Time:- Operating Temperature:- Operating Temper; Supplier Part: C34758; Manufacturer: OMRON(欧姆龙); Supplier Footprint: 插件,7x20.4mm; JLCPCB Part Class: Extended Part; Datasheet: https://atta.szlcsc.com/upload/public/pdf/source/20231016/A4DFA824C568B609EAF69B430D690266.pdf; Supplier: LCSC
R1-R4 R9-R18 R20-R35 R37-R47 = Res_0603: Supplier Footprint: 0603
SW1 = TS-1101-C-W: Circuit:SPST Actuator Style:Rectangle button Operating Force:260gf Mounting Style:Brick nogging Switch Length:6mm Switch Width:3.6mm Switch Height:2.5mm Strike Gundam:不带 Contact Current:50mA Voltage Rating (AC):- Voltage Rating (DC):12V Power Rating:- Ins; LCSC Part Name: 6*3.6*2.5mm 立贴 轻触开关; Supplier Part: C318938; Manufacturer: XKB Connectivity(中国星坤); Supplier Footprint: SMD; JLCPCB Part Class: Extended Part; Datasheet: https://atta.szlcsc.com/upload/public/pdf/source/20200227/C318938_C2E53B1EEDE37D980A33616AC086DE53.pdf; Supplier: LCSC; Circuit: SPST; Actuator Style: Rectangle button; Operating Force: 260gf; Mounting Style: Brick nogging; Switch Length: 6mm; Switch Width: 3.6mm; Switch Height: 2.5mm; Strike Gundam: 不带; Contact Current: 50mA; Voltage Rating (DC): 12V; Actuator/Cap Color: 白色带淡绿; With Lamp: No; Mechanical Life: 5万次; Operating Temperature: -30℃~+85℃
SW3-SW6 = ST-0-102-C03-N003-RS: Circuit:SPDT Mechanical Life:4万次 With Lamp:- Contact Current:3A Voltage Rating (AC):125V Voltage Rating (DC):- Actuator Type:Cylindrical button handle Pin Style:PCPin Mounting Style:- Operating Temperature:-25℃~+85℃ Operating Temperature:-25℃~+85℃; LCSC Part Name: 超小型钮子三脚二档(正弯脚); Supplier Part: C1788489; Manufacturer: YUEN FUNG(源丰); Supplier Footprint: 插件; JLCPCB Part Class: Extended Part; Datasheet: https://atta.szlcsc.com/upload/public/pdf/source/20201225/C1788489_FC77DF1FE334E292D58BD8615B26DB83.pdf; Supplier: LCSC; Circuit: SPDT; Mechanical Life: 4万次; Contact Current: 3A; Voltage Rating (AC): 125V; Actuator Type: Cylindrical button handle; Pin Style: PCPin; Operating Temperature: -25℃~+85℃
U2 U3 U6-U9 U25 = NE555N_C398063: LCSC Part Name: 时基集成芯片; Supplier Part: C398063; Manufacturer: HGSEMI(华冠); Supplier Footprint: DIP-8; JLCPCB Part Class: Extended Part; Datasheet: https://atta.szlcsc.com/upload/public/pdf/source/20210507/C398063_2BAEB56D23EF029756B1D4DE6D68B235.pdf; Supplier: LCSC
U26 = NE555P: Frequency:100kHz Supply Voltage:4.5V~16V Supply Voltage:4.5V~16V Supply Current:10mA Operating Temperature:0℃~+70℃ Operating Temperature:0℃~+70℃; Supplier Part: C46749; Manufacturer: TI(德州仪器); Supplier Footprint: DIP-8; JLCPCB Part Class: Extended Part; Datasheet: https://www.ti.com/cn/lit/gpn/ne555; Supplier: LCSC; Supply Voltage: 4.5V~16V; Supply Current: 10mA; Operating Temperature: 0℃~+70℃
L1-L4 = L_0603
Q10 = 2N7002,215: Type:1个NChannel Drain Source Voltage (Vdss): Continuous Drain Current (Id): Power Dissipation (Pd): Drain Source On Resistance (RDS(on)@Vgs,Id):5Ω@10V,500mA Gate Threshold Voltage (Vgs(th)@Id):2.5V@250uA Input Capacitance (Ciss@Vds):50pF@10V Operating Tem; LCSC Part Name: 1个N沟道 耐压:60V 电流:300mA; Supplier Part: C65189; Manufacturer: Nexperia(安世); Supplier Footprint: SOT-23; JLCPCB Part Class: Extended Part; Datasheet: https://atta.szlcsc.com/upload/public/pdf/source/20170103/1483439882638.pdf; Supplier: LCSC; Type: 1个NChannel; Drain Source On Resistance (RDS(on)@Vgs,Id): 5Ω@10V,500mA; Gate Threshold Voltage (Vgs(th)@Id): 2.5V@250uA; Input Capacitance (Ciss@Vds): 50pF@10V; Operating Temperature: -65℃~+150℃@(Tj)
R36 = RLM12FTCMR020: Resistance: Tolerance:±1% Tolerance:±1% Power(Watts): Temperature Coefficient:±50ppm/℃ Temperature Coefficient:±50ppm/℃; LCSC Part Name: 20mΩ ±1% 1W; Supplier Part: C393094; Manufacturer: 大毅科技; Supplier Footprint: 1206; JLCPCB Part Class: Extended Part; Datasheet: https://atta.szlcsc.com/upload/public/pdf/source/20190625/C393094_1D12BC44783F266A3BFDD0B943BC1FBD.pdf; Supplier: LCSC; Tolerance: ±1%; Temperature Coefficient: ±50ppm/℃
U10 = EL3H7(C)(TA)-G: Input voltage type:DC Output Type:光电三极管 Forward Voltage:1.2V Output Current:50mA Isolation Voltage(rms):3.75kV Reverse Voltage:6V Load Voltage:80V Number of Outputs:1 Collector-Emitter Saturation Voltage (Vce(sat)@Ic,IF):100mV@1mA,10mA Rise time:5us@2mA,1; LCSC Part Name: DC输入 隔离电压(rms):3750V; Supplier Part: C92243; Manufacturer: EVERLIGHT(亿光); Supplier Footprint: SSOP-4-1.27mm; JLCPCB Part Class: Extended Part; Datasheet: https://atta.szlcsc.com/upload/public/pdf/source/20180207/C181879_15179899084781356541.pdf; Supplier: LCSC; Input voltage type: DC; Output Type: 光电三极管; Forward Voltage: 1.2V; Output Current: 50mA; Isolation Voltage(rms): 3.75kV; Reverse Voltage: 6V; Load Voltage: 80V; Number of Outputs: 1; Collector-Emitter Saturation Voltage (Vce(sat)@Ic,IF): 100mV@1mA,10mA; Rise time: 5us@2mA,100Ω; Fall time: 3us@2mA,100Ω; Operating Temperature: -55℃~+110℃
U11 = SN74HCT14DR: Input Type:Schmitt Trigger Supply Voltage(Single):4.5V~5.5V Supply Voltage(Single):4.5V~5.5V Supply Current (Max):2uA Number of Circuits:6 Number of Inputs:1 Sink Current:4mA Source Current:4mA High level range (VIH):1.9V~2.1V High level range (VIH):1.9V~; LCSC Part Name: 六路施密特触发反相器; Supplier Part: C6769; Manufacturer: TI(德州仪器); Supplier Footprint: SOIC-14; JLCPCB Part Class: Extended Part; Datasheet: https://www.ti.com/cn/lit/gpn/sn74hct14; Supplier: LCSC; Input Type: Schmitt Trigger; Supply Voltage(Single): 4.5V~5.5V; Supply Current (Max): 2uA; Number of Circuits: 6; Number of Inputs: 1; Sink Current: 4mA; Source Current: 4mA; High level range (VIH): 1.9V~2.1V; Low level range (VIL): 500mV~600mV; Max Propagation Delay: 30ns@5.5V,50pF; Series: 74HCTSeries; Operating Temperature: -40℃~+85℃
U12 = ADS1015IDGSR: Supplier Part: C193969; Manufacturer: TI(德州仪器); Supplier Footprint: VSSOP-10-0.5mm; JLCPCB Part Class: Extended Part; Datasheet: https://www.ti.com/cn/lit/gpn/ads1015; Supplier: LCSC
U17 U18 U20-U22 U24 = UA741CD: Number of Circuits:单路 Gain Bandwidth Product(GBP):1MHz Current - Input Bias(Ib):10nA Slew Rate(SR):0.5V/us Output Current:25mA -3db Bandwidth:- Operating Temperature:0℃~+70℃ Operating Temperature:0℃~+70℃; Supplier Part: C1346799; Manufacturer: ST(意法半导体); Supplier Footprint: SO-8; JLCPCB Part Class: Extended Part; Datasheet: https://atta.szlcsc.com/upload/public/pdf/source/20211229/F5D7931C1428D962D9179141BCF887F3.pdf; Supplier: LCSC; Number of Circuits: 单路; Gain Bandwidth Product(GBP): 1MHz; Current - Input Bias(Ib): 10nA; Slew Rate(SR): 0.5V/us; Output Current: 25mA; Operating Temperature: 0℃~+70℃
U23 = DS18B20: Temperature range:-55℃~+125℃ Temperature range:-55℃~+125℃ Resolution:±0.4℃ Resolution:±0.4℃ Supply Voltage:3V~5.5V Supply Voltage:3V~5.5V Standby Current:- Interface Type:-; Supplier Part: C376006; Manufacturer: UMW(友台半导体); Supplier Footprint: TO-92; JLCPCB Part Class: Extended Part; Datasheet: https://atta.szlcsc.com/upload/public/pdf/source/20231109/DC3DA9D47D486EF40A6E0F08B9A498E3.pdf; Supplier: LCSC; Temperature range: -55℃~+125℃; Resolution: ±0.4℃; Supply Voltage: 3V~5.5V
DSUB1 DSUB2 = D-DMR009PF-D002: Connector Type:D-Sub Gender:Female Number of Pins:9P Mounting Style:Right-Angle Number of Rows:2 Current Rating (Max):3A Operating Temperature Range:-50℃~+105℃ Operating Temperature Range:-50℃~+105℃; LCSC Part Name: D-Sub 母 P数:9P; Supplier Part: C141882; Manufacturer: Ckmtw(灿科盟); Supplier Footprint: 弯插; JLCPCB Part Class: Extended Part; Datasheet: https://atta.szlcsc.com/upload/public/pdf/source/20171123/C141882_15114109686951137625.pdf; Supplier: LCSC; Connector Type: D-Sub; Gender: Female; Number of Pins: 9P; Mounting Style: Right-Angle; Number of Rows: 2; Current Rating (Max): 3A; Operating Temperature Range: -50℃~+105℃
RJ1 = R-RJ45R08P-C000: Connector Type:RJReceptacle USOC Codes:RJ45 Number of Ports:1 Mounting Style:Right-Angle Shielding:有屏蔽 LED:WithLED Ratings:- Operating Temperature Range:0℃~+70℃ Operating Temperature Range:0℃~+70℃; LCSC Part Name: RJ45 弯插 带LED; Supplier Part: C386757; Manufacturer: Ckmtw(灿科盟); Supplier Footprint: 插件; JLCPCB Part Class: Extended Part; Datasheet: https://atta.szlcsc.com/upload/public/pdf/source/20190508/C386757_590BCC8A33AAEEF7838490D656B2E4CF.pdf; Supplier: LCSC; Connector Type: RJReceptacle; USOC Codes: RJ45; Number of Ports: 1; Mounting Style: Right-Angle; Shielding: 有屏蔽; LED: WithLED; Operating Temperature Range: 0℃~+70℃
U13 = MAX232N: Types:transceiver Driver/receiver:2/2 Data Rate:120Kbps Data Rate:120Kbps Supply Voltage:4.5V~5.5V Supply Voltage:4.5V~5.5V Operating Temperature:0℃~+70℃ Operating Temperature:0℃~+70℃; Supplier Part: C353147; Manufacturer: TI(德州仪器); Supplier Footprint: PDIP-16; JLCPCB Part Class: Extended Part; Datasheet: https://www.ti.com/cn/lit/gpn/max232; Supplier: LCSC; Types: transceiver; Driver/receiver: 2/2; Data Rate: 120Kbps; Supply Voltage: 4.5V~5.5V; Operating Temperature: 0℃~+70℃
U16 = LAN8720A-CP-TR: Application Function:Transceiver Number of Channels: Interface: Supply Voltage:1.6V~3.6V Supply Voltage:1.6V~3.6V Operating Temperature:0℃~+85℃ Operating Temperature:0℃~+85℃; Supplier Part: C45223; Manufacturer: MICROCHIP(美国微芯); Supplier Footprint: QFN-24-EP(4x4); JLCPCB Part Class: Extended Part; Datasheet: https://atta.szlcsc.com/upload/public/pdf/source/20151012/1457707444106.pdf; Supplier: LCSC; Application Function: Transceiver; Supply Voltage: 1.6V~3.6V; Operating Temperature: 0℃~+85℃
D1-D8 = 1N4007: Supplier Footprint: DO-41
D9 = BZT52C5V1_C726995: Zener Voltage (Nom):5.1V Reverse Leakage Current (Ir):2uA@2V Power Dissipation:500mW Tolerance:- Tolerance:-; Supplier Part: C726995; Manufacturer: TWGMC(台湾迪嘉); Supplier Footprint: SOD-123; JLCPCB Part Class: Extended Part; Datasheet: https://atta.szlcsc.com/upload/public/pdf/source/20200825/C726987_AA6CB64B7861C942BF0EE5963BB1FA70.pdf; Supplier: LCSC; Zener Voltage (Nom): 5.1V; Reverse Leakage Current (Ir): 2uA@2V; Power Dissipation: 500mW
U14 = LM2576S-12_C347414: Function:Step-down type Output Type:Fixed Input Voltage:40V Input Voltage:40V Output Voltage:12V Output Voltage:12V Output Current (Max):3A Switching Frequency:52kHz Operating Temperature:-40℃~+125℃@(TA) Operating Temperature:-40℃~+125℃@(TA) Synchronous R; Supplier Part: C347414; Manufacturer: UMW(友台半导体); Supplier Footprint: TO-263-5; JLCPCB Part Class: Extended Part; Datasheet: https://atta.szlcsc.com/upload/public/pdf/source/20231109/97ACD99236AD6FA78302E85E1B8CCF74.pdf; Supplier: LCSC; Function: Step-down type; Output Type: Fixed; Input Voltage: 40V; Output Voltage: 12V; Output Current (Max): 3A; Switching Frequency: 52kHz; Operating Temperature: -40℃~+125℃@(TA); Synchronous Rectification: Yes; Number of Outputs: 1; Topology: Step-down; Quiescent Current (Iq): 5mA; Switch tube (built-in/external): 内置
U15 = M3406-ADJ_C83224: Function:Step-down type Input Voltage:- Input Voltage:- Output Current (Max):- Switching Frequency:- Synchronous Rectification:- Number of Outputs:- Topology:- Switch tube (built-in/external):内置; Supplier Part: C83224; Manufacturer: 西安航天民芯; Supplier Footprint: SOT-23-5; JLCPCB Part Class: Extended Part; Datasheet: https://atta.szlcsc.com/upload/public/pdf/source/20180301/C181743_15198944852831384030.pdf; Supplier: LCSC; Function: Step-down type; Switch tube (built-in/external): 内置
U19 = TPS7A3401DGNR: Output Type:可调 Maximum Input Voltage:20V Output Voltage:1.18V~18V Output Voltage:1.18V~18V MAX Output Current:200mA Power Supply Rejection Ratio (PSRR):50dB@(1kHz) Dropout Voltage:0.8V@(200mA) standby current:100uA Operating Temperature:-40℃~+125℃ Operati; Supplier Part: C2879160; Manufacturer: TI(德州仪器); Supplier Footprint: MSOP-8-EP; JLCPCB Part Class: Extended Part; Datasheet: https://www.ti.com/cn/lit/gpn/tps7a3401; Supplier: LCSC; Output Type: 可调; Maximum Input Voltage: 20V; Output Voltage: 1.18V~18V; MAX Output Current: 200mA; Power Supply Rejection Ratio (PSRR): 50dB@(1kHz); Dropout Voltage: 0.8V@(200mA); standby current: 100uA; Operating Temperature: -40℃~+125℃; Output Polarity: Negative electrode; Number of Outputs: 1
RLY1 = G6S-2 DC24: Coil Voltage:24V Contact Form:两组转换:2C(DPDT-转换) Pin Number:- Contact Rating:- Maximum Switching Voltage:250V@AC；220V@DC Contact Material:silver+Gold plating Coil Resistance:- Maximum Switching Current:2A Operate Time:4ms Release Time:4ms Coil Type:- Contac; LCSC Part Name: G6S-2-24V; Supplier Part: C15990; Manufacturer: OMRON(欧姆龙); Supplier Footprint: DIP,7.3x14.8mm; JLCPCB Part Class: Extended Part; Supplier: LCSC; Coil Voltage: 24V; Contact Form: 两组转换:2C(DPDT-转换); Maximum Switching Voltage: 250V@AC；220V@DC; Contact Material: silver+Gold plating; Maximum Switching Current: 2A; Operate Time: 4ms; Release Time: 4ms; Operating Temperature: -40℃~+85℃
U27 = AD737JRZ-R7: Supply Voltage:3.2V~16.5V；2.8V Supply Voltage:3.2V~16.5V；2.8V Supply Current:170uA; Supplier Part: C359075; Manufacturer: ADI(亚德诺); Supplier Footprint: SOIC-8; JLCPCB Part Class: Extended Part; Datasheet: https://atta.szlcsc.com/upload/public/pdf/source/20200225/C359075_EB075709A532333C547BC4A573FAC775.pdf; Supplier: LCSC; Supply Voltage: 3.2V~16.5V；2.8V; Supply Current: 170uA
U28 = AiP74HC245TA20.TR: LCSC Part Name: 带三态控制的八路总线收发器; Supplier Part: C3007556; Manufacturer: I-CORE(中微爱芯); Supplier Footprint: TSSOP-20; JLCPCB Part Class: Extended Part; Datasheet: https://atta.szlcsc.com/upload/public/pdf/source/20220505/D887D6ED9603D1DE24457E1640BA812B.pdf; Supplier: LCSC
U29 = SN74LVC1G86DCKR: Logic Gate Type:XORGate Number of Channels:1 Supply Voltage:1.65V~5.5V Supply Voltage:1.65V~5.5V Quiescent Current (Max):10uA Sink Current:32mA Source Current:32mA High Level Range (VIH):1.7V~2V High Level Range (VIH):1.7V~2V Low Level Range (VIL):700mV~8; Supplier Part: C52350; Manufacturer: TI(德州仪器); Supplier Footprint: SC-70-5; JLCPCB Part Class: Extended Part; Datasheet: https://www.ti.com/cn/lit/gpn/sn74lvc1g86; Supplier: LCSC; Logic Gate Type: XORGate; Number of Channels: 1; Supply Voltage: 1.65V~5.5V; Quiescent Current (Max): 10uA; Sink Current: 32mA; Source Current: 32mA; High Level Range (VIH): 1.7V~2V; Low Level Range (VIL): 700mV~800mV; Series: 74LVCSeries; Propagation Delay Time: 4ns@5V,50pF; Operating Temperature: -40℃~+125℃
U30 = LM331M/TR: Supply Voltage:40V Supply Voltage:40V Frequency:100kHz Degree of linearity:- Degree of linearity:- Conversion Type VF/FV:V/F Operating Temperature:0℃~+70℃ Operating Temperature:0℃~+70℃; LCSC Part Name: 精密压频转换器; Supplier Part: C565349; Manufacturer: HGSEMI(华冠); Supplier Footprint: SOP-8; JLCPCB Part Class: Extended Part; Datasheet: https://atta.szlcsc.com/upload/public/pdf/source/20200709/C565349_1199213407AE4F9EA1DDE0FEBB4238FA.pdf; Supplier: LCSC; Supply Voltage: 40V; Conversion Type VF/FV: V/F; Operating Temperature: 0℃~+70℃
U31 = SN74HC148DR: Type:Priority Encoders Voltage Supply Source:Single supply Supply Voltage:2V~6V Supply Voltage:2V~6V Sink Current:5.2mA Source Current:5.2mA Operating temperature:-40℃~+85℃ Operating temperature:-40℃~+85℃; Supplier Part: C6819; Manufacturer: TI(德州仪器); Supplier Footprint: SOIC-16; JLCPCB Part Class: Extended Part; Datasheet: https://www.ti.com/cn/lit/gpn/sn74hc148; Supplier: LCSC; Type: Priority Encoders; Voltage Supply Source: Single supply; Supply Voltage: 2V~6V; Sink Current: 5.2mA; Source Current: 5.2mA; Operating temperature: -40℃~+85℃

## Nets
+VDD: L4.2 U15.4(VIN) U17.7(VCC+) U18.7(VCC+) U20.7(VCC+) U21.7(VCC+) U22.7(VCC+) U24.7(VCC+)
-VDD: U17.4(VCC-) U18.4(VCC-) U19.1(OUT) U20.4(VCC-) U21.4(VCC-) U22.4(VCC-) U24.4(VCC-)
AGND: Q2.3(E) Q4.3(E) Q6.3(E) Q8.2(S) Q10.2(S) R17.1
GND: C2.2 C4.1 C5.1 C8.1 C9.1 C10.1 C11.1 C17.2 C18.1 C20.1 D1.2(A) D3.2(A) D6.1(K) D8.1(K) D9.2(A) DSUB1.5 DSUB2.5 Q12.2(S) Q13.2(S) R37.2 R38.1 SW1.2 U2.1(GND) U3.1(GND) U6.1(GND) U7.1(GND) U8.1(GND) U9.1(GND) U10.2 U13.15(GND) U14.3(Gnd) U15.2(GND) U17.3(+ input) U18.3(+ input) U20.3(+ input) U21.3(+ input) U22.3(+ input) U23.1(GND) U25.1(GND)
VCC: BUZZER1.1 C2.1 C19.1 J1.4 Q6.1(G) R1.1 R3.1 R9.1 R11.1 R13.1 R15.1 R36.2 RJ1.9(L+) RJ1.11(R+) SW3.2 SW4.2 SW5.2 SW6.2 U1.3(VCC) U1.4(GND) U2.4(RESET) U2.8(VCC) U3.4(RESET) U3.8(VCC) U6.4(RESET) U6.8(VCC) U7.4(RESET) U7.8(VCC) U8.4(RESET) U8.8(VCC) U9.4(RESET) U9.8(VCC) U10.4 U13.16(VCC) U23.3(VDD) U24.2(- input) U25.8(VCC) U26.8(VCC)
VDD1: Q9.3(D)
VDD2: Q10.3(D)
VDD3: Q11.3(D) Q14.3(D)
NET1: C3.2 Q1.3(E) Q2.2(C) Q3.3(E) Q4.2(C) Q5.3(E) Q6.2(C) Q7.2(S) Q8.3(D) U1.6(OUT)
NET2: R18.1
NET4: Q9.1(G) U2.2(TRIG) U3.2(TRIG) U6.2(TRIG) U7.2(TRIG)
NET5: Q2.1(G) U8.2(TRIG)
NET6: Q1.1(G) U9.2(TRIG)
NET7: Q4.1(G) U11.1(1A)
NET8: Q3.1(G) Q11.1(G) Q12.1(G) Q13.1(G) Q14.1(G) U11.2(1Y)
NET10: D1.1(K) D2.2(A) Q5.1(G)
NET11: D7.1(K) D8.2(A) Q7.3(D) U1.1(LIN)
NET12: Q11.2(S) Q12.3(D) U1.2(HIN)
NET13: Q1.2(C) Q3.2(C) Q5.2(C) Q9.2(S) Q13.3(D) Q14.2(S)
NET14: C12.2 C14.2 L1.1 R20.2 R21.2 R25.2 R26.1 U2.3(OUT) U3.3(OUT) U6.3(OUT) U7.3(OUT)
NET15: C16.1 R28.2 R35.2 U8.3(OUT) U18.6(Output) U22.6(Output)
NET16: D3.1(K) D4.2(A) U9.3(OUT)
NET17: D5.1(K) D6.2(A)
NET18: C17.1 D2.1(K) D4.1(K) U14.1(Vin)
NET19: U13.11(T1IN)
NET20: U13.10(T2IN)
NET21: U13.12(R1OUT)
NET22: U13.9(R2OUT)
NET23: RJ1.10(L-)
NET24: RJ1.12(R-)
Net-(BUZZER1-2): BUZZER1.2 U25.3(OUT)
Net-(C3-1): C3.1 U1.8(VBOOT)
Net-(C4-2): C4.2 U2.5(CONT)
Net-(C5-2): C5.2 U3.5(CONT)
Net-(C8-2): C8.2 U6.5(CONT)
Net-(C9-2): C9.2 U7.5(CONT)
Net-(C10-2): C10.2 U8.5(CONT)
Net-(C11-2): C11.2 U9.5(CONT)
Net-(C12-1): C12.1 C13.1 U12.5(AIN1)
Net-(C13-2): C13.2 C14.1
Net-(C15-1): C15.1 R27.2 R29.1 U17.6(Output)
Net-(C15-2): C15.2 R26.2 R27.1 U17.2(- input)
Net-(C16-2): C16.2 R28.1 R29.2 U18.2(- input)
Net-(C18-2): C18.2 D5.2(A) D7.2(A) U19.8(IN)
Net-(C19-2): C19.2 U13.2(V+)
Net-(C20-2): C20.2 U13.6(V-)
Net-(D9-1): D9.1(K) L4.1 U14.2(Output)
Net-(DSUB1-2): DSUB1.2 U13.14(T1OUT)
Net-(DSUB1-3): DSUB1.3 U13.13(R1IN)
Net-(DSUB2-2): DSUB2.2 U13.7(T2OUT)
Net-(DSUB2-3): DSUB2.3 U13.8(R2IN)
Net-(J1-1): J1.1 U26.3(OUT)
Net-(L1-2): L1.2 L2.1
Net-(L2-2): L2.2 R23.2
Net-(L3-1): L3.1 U15.3(SW)
Net-(Q7-1): Q7.1(G) U1.7(HVG)
Net-(Q8-1): Q8.1(G) U1.5(LVG)
Net-(Q10-1): Q10.1(G) R17.2 U10.3
Net-(R1-2): R1.2 R2.1 U2.7(DISCH)
Net-(R2-2): R2.2 U2.6(THRES)
Net-(R3-2): R3.2 R4.1 U3.7(DISCH)
Net-(R4-2): R4.2 U3.6(THRES)
Net-(R9-2): R9.2 R10.1 U6.7(DISCH)
Net-(R10-2): R10.2 U6.6(THRES)
Net-(R11-2): R11.2 R12.1 U7.7(DISCH)
Net-(R12-2): R12.2 U7.6(THRES)
Net-(R13-2): R13.2 R14.1 U8.7(DISCH)
Net-(R14-2): R14.2 U8.6(THRES)
Net-(R15-2): R15.2 R16.1 U9.7(DISCH)
Net-(R16-2): R16.2 U9.6(THRES)
Net-(R18-2): R18.2 U10.1
Net-(R20-1): R20.1 R22.1 U12.4(AIN0)
Net-(R21-1): R21.1 R22.2
Net-(R23-1): R23.1 R24.1 U12.6(AIN2)
Net-(R24-2): R24.2 R25.1
Net-(R30-1): R30.1 U23.2(DQ)
Net-(R30-2): R30.2 R31.1 U20.2(- input)
Net-(R31-2): R31.2 R33.1 U20.6(Output)
Net-(R32-1): R32.1 R33.2 U21.2(- input)
Net-(R32-2): R32.2 R34.1 U21.6(Output)
Net-(R34-2): R34.2 R35.1 U22.2(- input)
Net-(R36-1): R36.1 R37.1 U24.3(+ input)
Net-(R38-2): R38.2 RJ1.8 RJ1.13(S) RJ1.14(S)
Net-(R39-1): R39.1 R40.1 R41.1 R42.1 U25.6(THRES) U25.7(DISCH)
Net-(R39-2): R39.2 SW3.3
Net-(R40-2): R40.2 SW4.3
Net-(R41-2): R41.2 SW5.3
Net-(R42-2): R42.2 SW6.3
Net-(RJ1-2): RJ1.2 RJ1.5
Net-(SW1-1): SW1.1 U25.4(RESET)
Net-(U12-7): U12.7(AIN3) U24.6(Output)

Not connected (* = marked no-connect by the designer): DSUB1 1 4 6 7 8 9 10(MH1) 11(MH2); DSUB2 1 4 6 7 8 9 10(MH1) 11(MH2); J1 2 3; L3 2; R43 1 2; R44 1 2; R45 1 2; R46 1 2; R47 1 2; RJ1 1 3 4 6 7; RLY1 1 3 4 5 8 9 10 12; SW3 1 4 5; SW4 1 4 5; SW5 1 4 5; SW6 1 4 5; U11 3(2A) 4(2Y) 5(3A) 6(3Y) 7(GND) 8(4Y) 9(4A) 10(5Y) 11(5A) 12(6Y) 13(6A) 14(VCC); U12 1(ADDR) 2(ALERT/RDY) 3(GND) 8(VDD) 9(SDA) 10(SCL); U13 1(C1+) 3(C1-) 4(C2+) 5(C2-); U14 4(Feedback) 5(ON#/OFF) 6(TAB); U15 1(RUN) 5(FB); U16 1(VDD2A) 2(LED2/nINTSEL) 3(LED1/REGOFF) 4(XTAL2) 5(XTAL1/CLKIN) 6(VDDCR) 7(RXD1/MODE1) 8(RXD0/MODE0) 9(VDDIO) 10(RXER/PHYAD0) 11(CRS_DV/MODE2) 12(MDIO) 13(MDC) 14(nINT/REFCLKO) 15(nRST) 16(TXEN) 17(TXD0) 18(TXD1) 19(VDD1A) 20(TXN) 21(TXP) 22(RXN) 23(RXP) 24(RBIAS) 25(EP); U17 1(null1)* 5(null2)* 8(N.C.)*; U18 1(null1)* 5(null2)* 8(N.C.)*; U19 2(FB) 3(GND) 4(GND) 5(EN) 6(GND) 7(GND) 9(EP); U20 1(null1)* 5(null2)* 8(N.C.)*; U21 1(null1)* 5(null2)* 8(N.C.)*; U22 1(null1)* 5(null2)* 8(N.C.)*; U24 1(null1)* 5(null2)* 8(N.C.)*; U25 2(TRIG) 5(CONT); U26 1(GND) 2(TRIG) 4(RESET) 5(CONT) 6(THRES) 7(DISCH); U27 1(CC) 2(VIN) 3(POWER_DOWN) 4(-VS) 5(CAV) 6(OUT_PUT) 7(+VS) 8(COM); U28 1(DIR) 2(A0) 3(A1) 4(A2) 5(A3) 6(A4) 7(A5) 8(A6) 9(A7) 10(GND) 11(B7) 12(B6) 13(B5) 14(B4) 15(B3) 16(B2) 17(B1) 18(B0) 19(OE#) 20(VCC); U29 1(A) 2(B) 3(GND) 4(Y) 5(VCC); U30 1(CURR_OUT) 2(REF_CURR) 3(FREQ_OUT) 4(GND) 5(R/C) 6(THRESHOLD) 7(COMP_IN) 8(VC); U31 1(4) 2(5) 3(6) 4(7) 5(EI) 6(A2) 7(A1) 8(GND) 9(A0) 10(0) 11(1) 12(2) 13(3) 14(GS) 15(EO) 16(VCC)

# Board PCB1
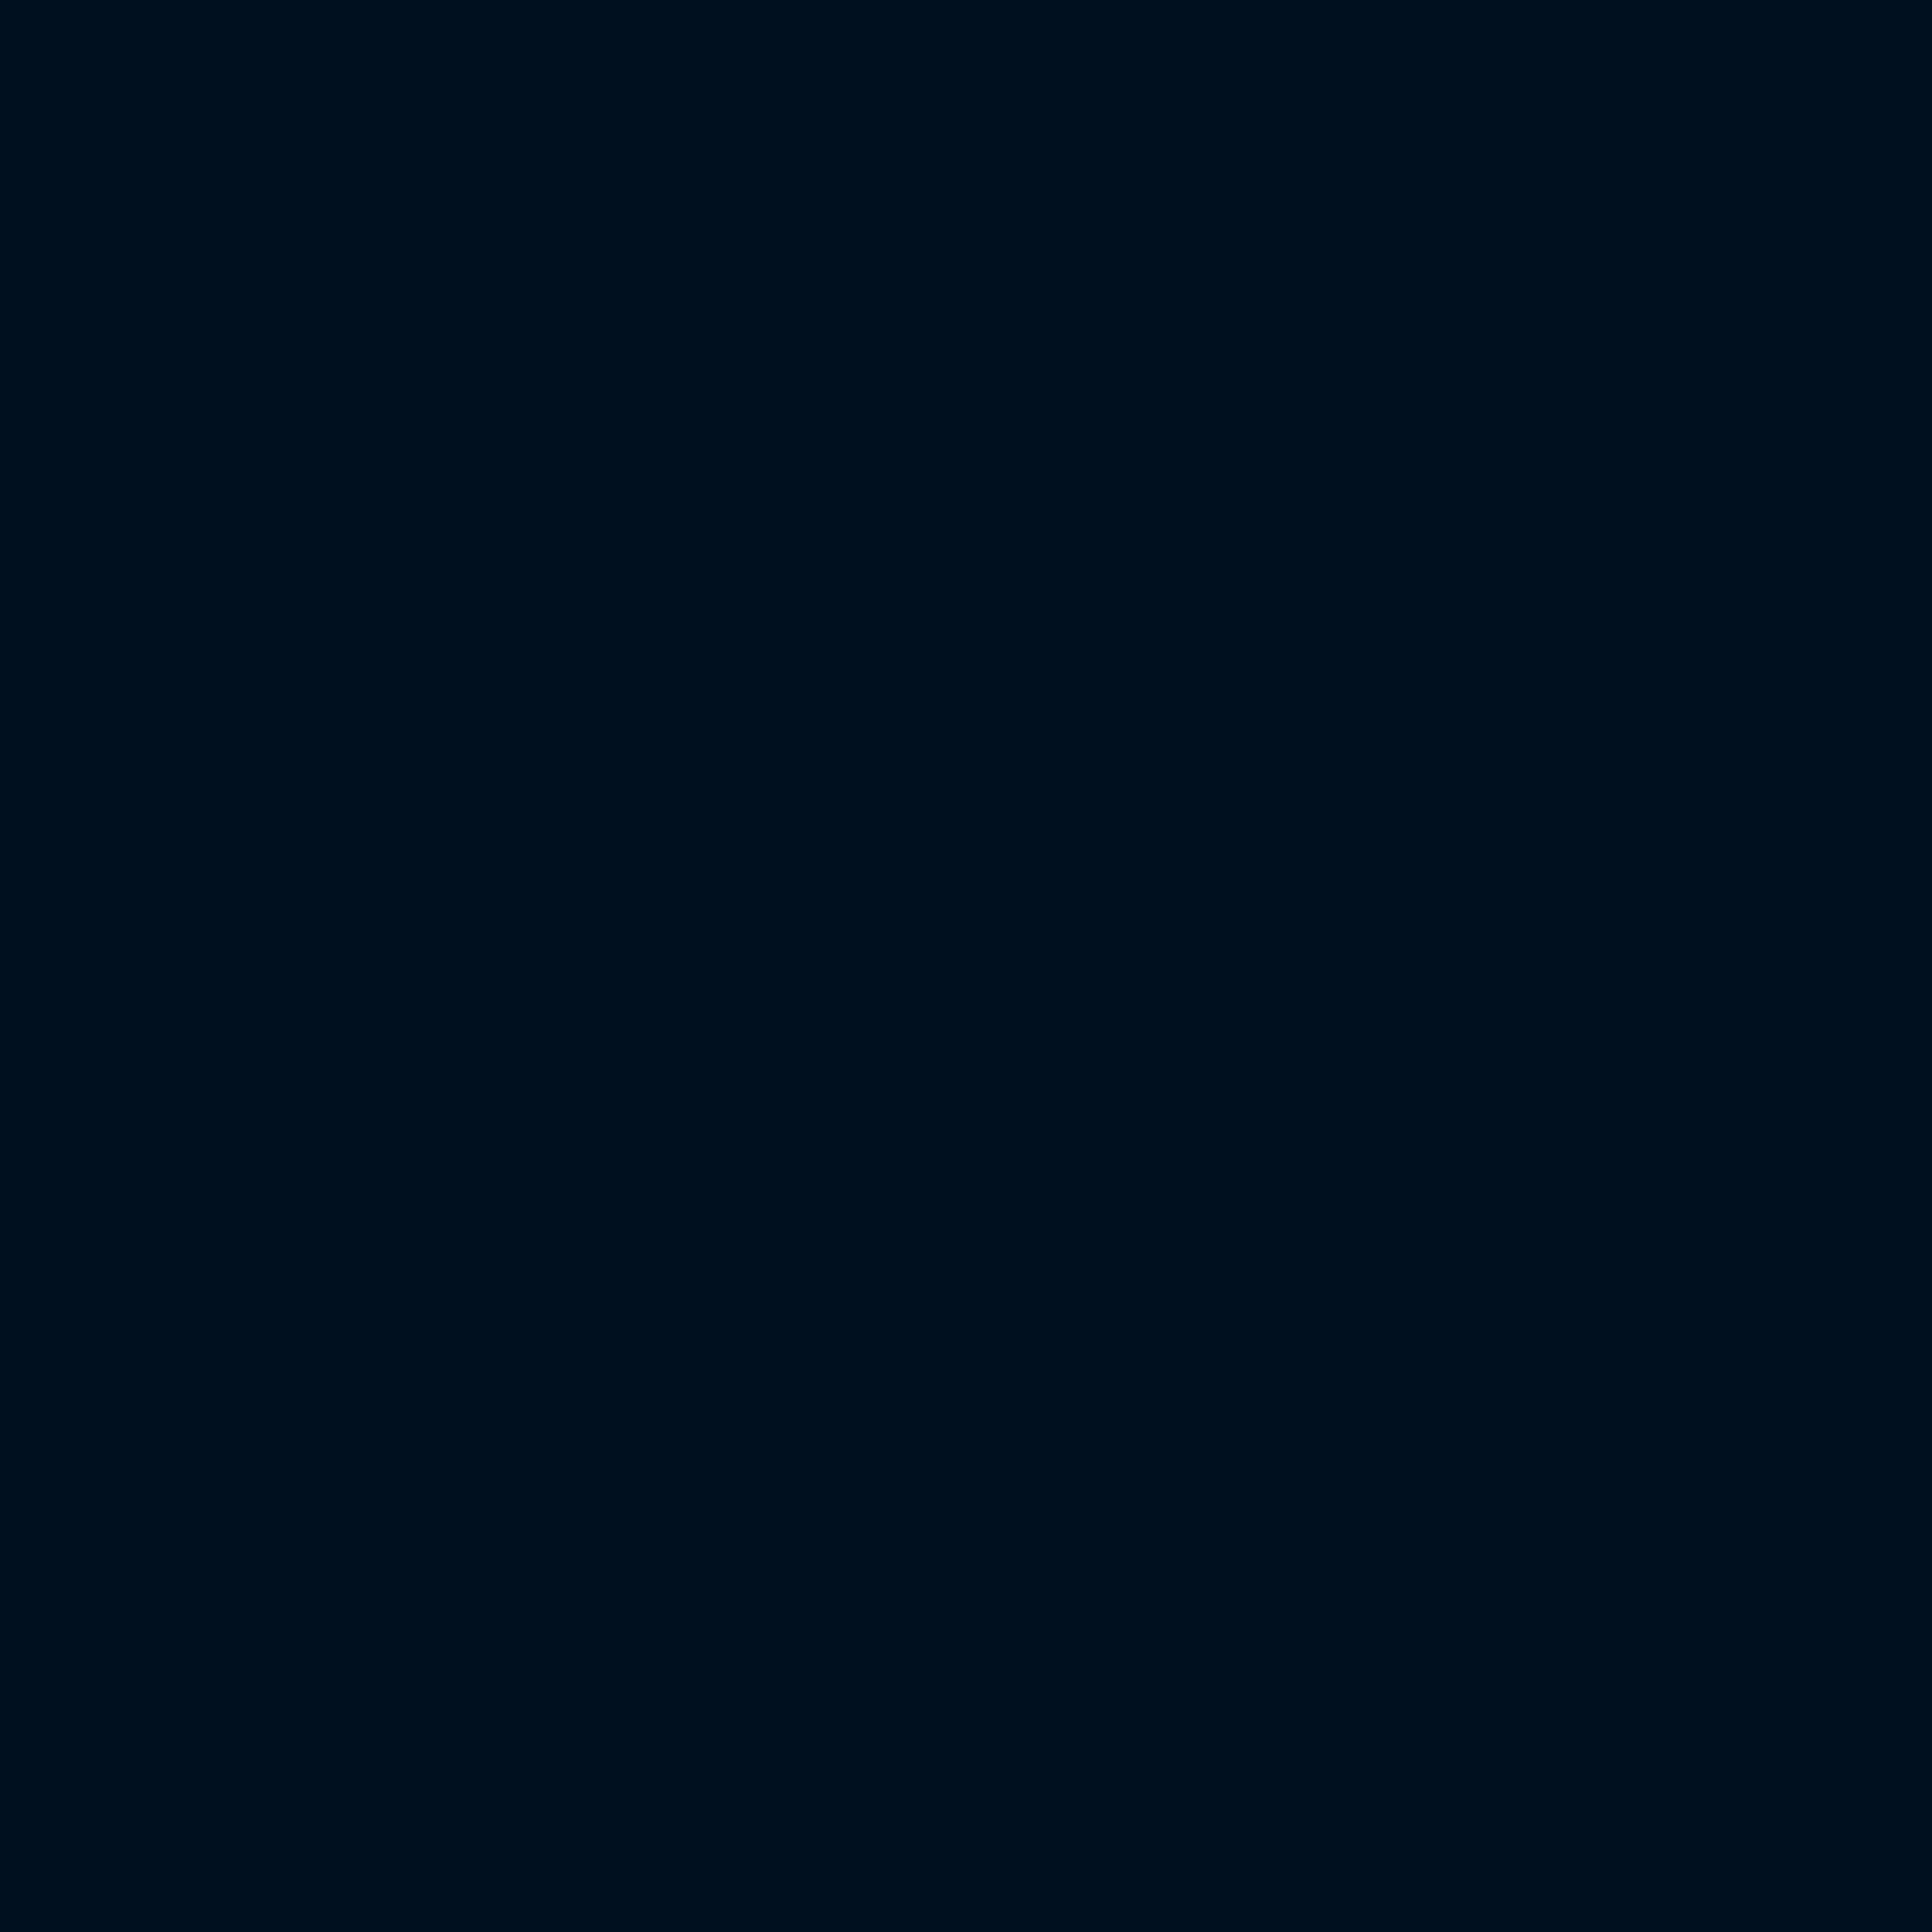
[diagram p6: board, top side]
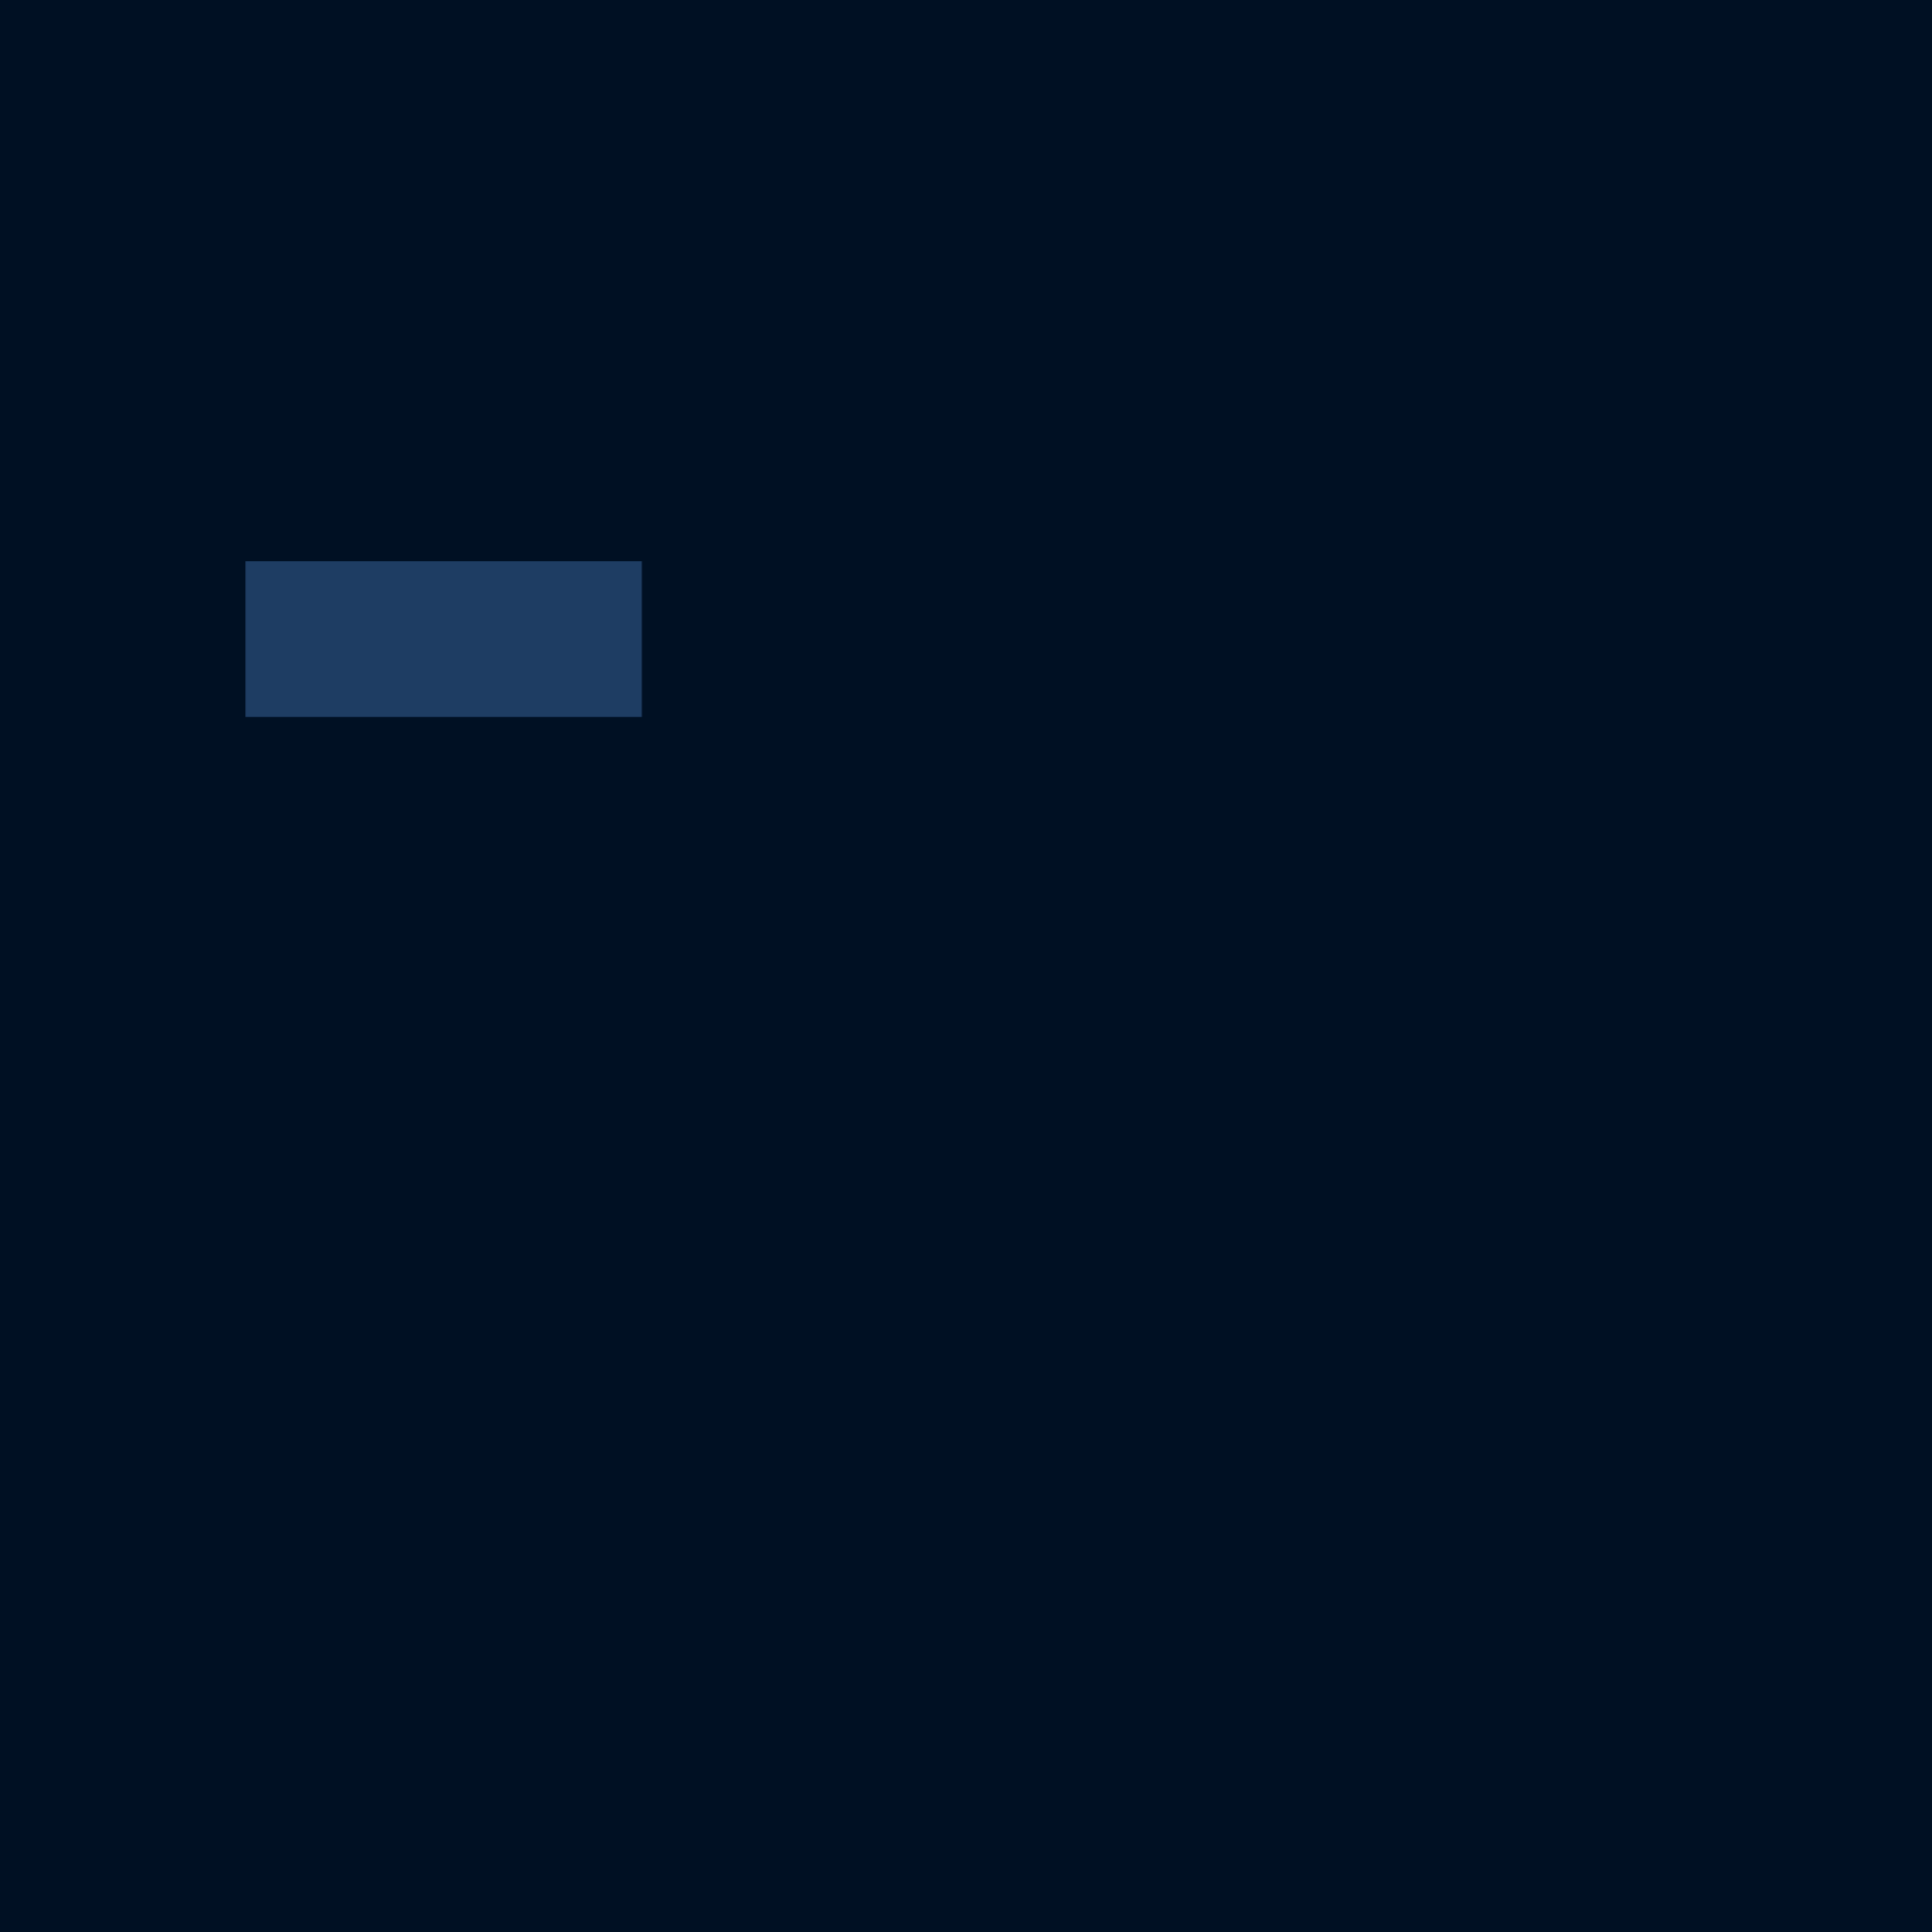
[diagram p7: board, bottom side, seen from below]

No outline. copper layers: Top Layer, Bottom Layer. Coordinates in mm from the lowest, leftmost part position.
Stack: Top Layer 0.035mm / Dielectric1 1.51mm FR4 er 4.5 / Bottom Layer 0.035mm

## Design rules (mm)
template: JLCPCB Capability(Two Layers Board)
spacing copperThickness1oz (default): track to track 0.102, other pairs 0.152 to 0.3
spacing copperThickness2oz: track to track 0.203, other pairs 0.152 to 0.3
track width copperThickness1oz (default): min 0.127, default 0.254, max 2.54
track width copperThickness2oz: min 0.203, default 0.254, max 2.54
differential pair differentialPair (default): width min 0.127, default 0.254, max 2.54; gap min 0.152, default 0.152
via viaSize (default): diameter min 0.5, default 0.61, max 10; hole min 0.3, default 0.305, max 6.3

## Placement (name value [footprint] x y rotation side)

## Nets
As in the schematic.

## Copper pours and planes (outline as drawn; the poured copper is in the pictures)
(no net) on Bottom Layer: 67.45,-28.21 88.79,-28.21 88.79,-36.59 67.45,-36.59
